# EAGLE schematic PDNode-600 Pro1 (EAGLE 9.2.1), part 1 of 3
COMPANY: DvidMakesThings; REVISION: 1.0.0; WEB: https://github.com/DvidMakesThings/HW_PDNode-600-Pro

## Sheet 1 of 15: MICROCONTROLLER - POWER
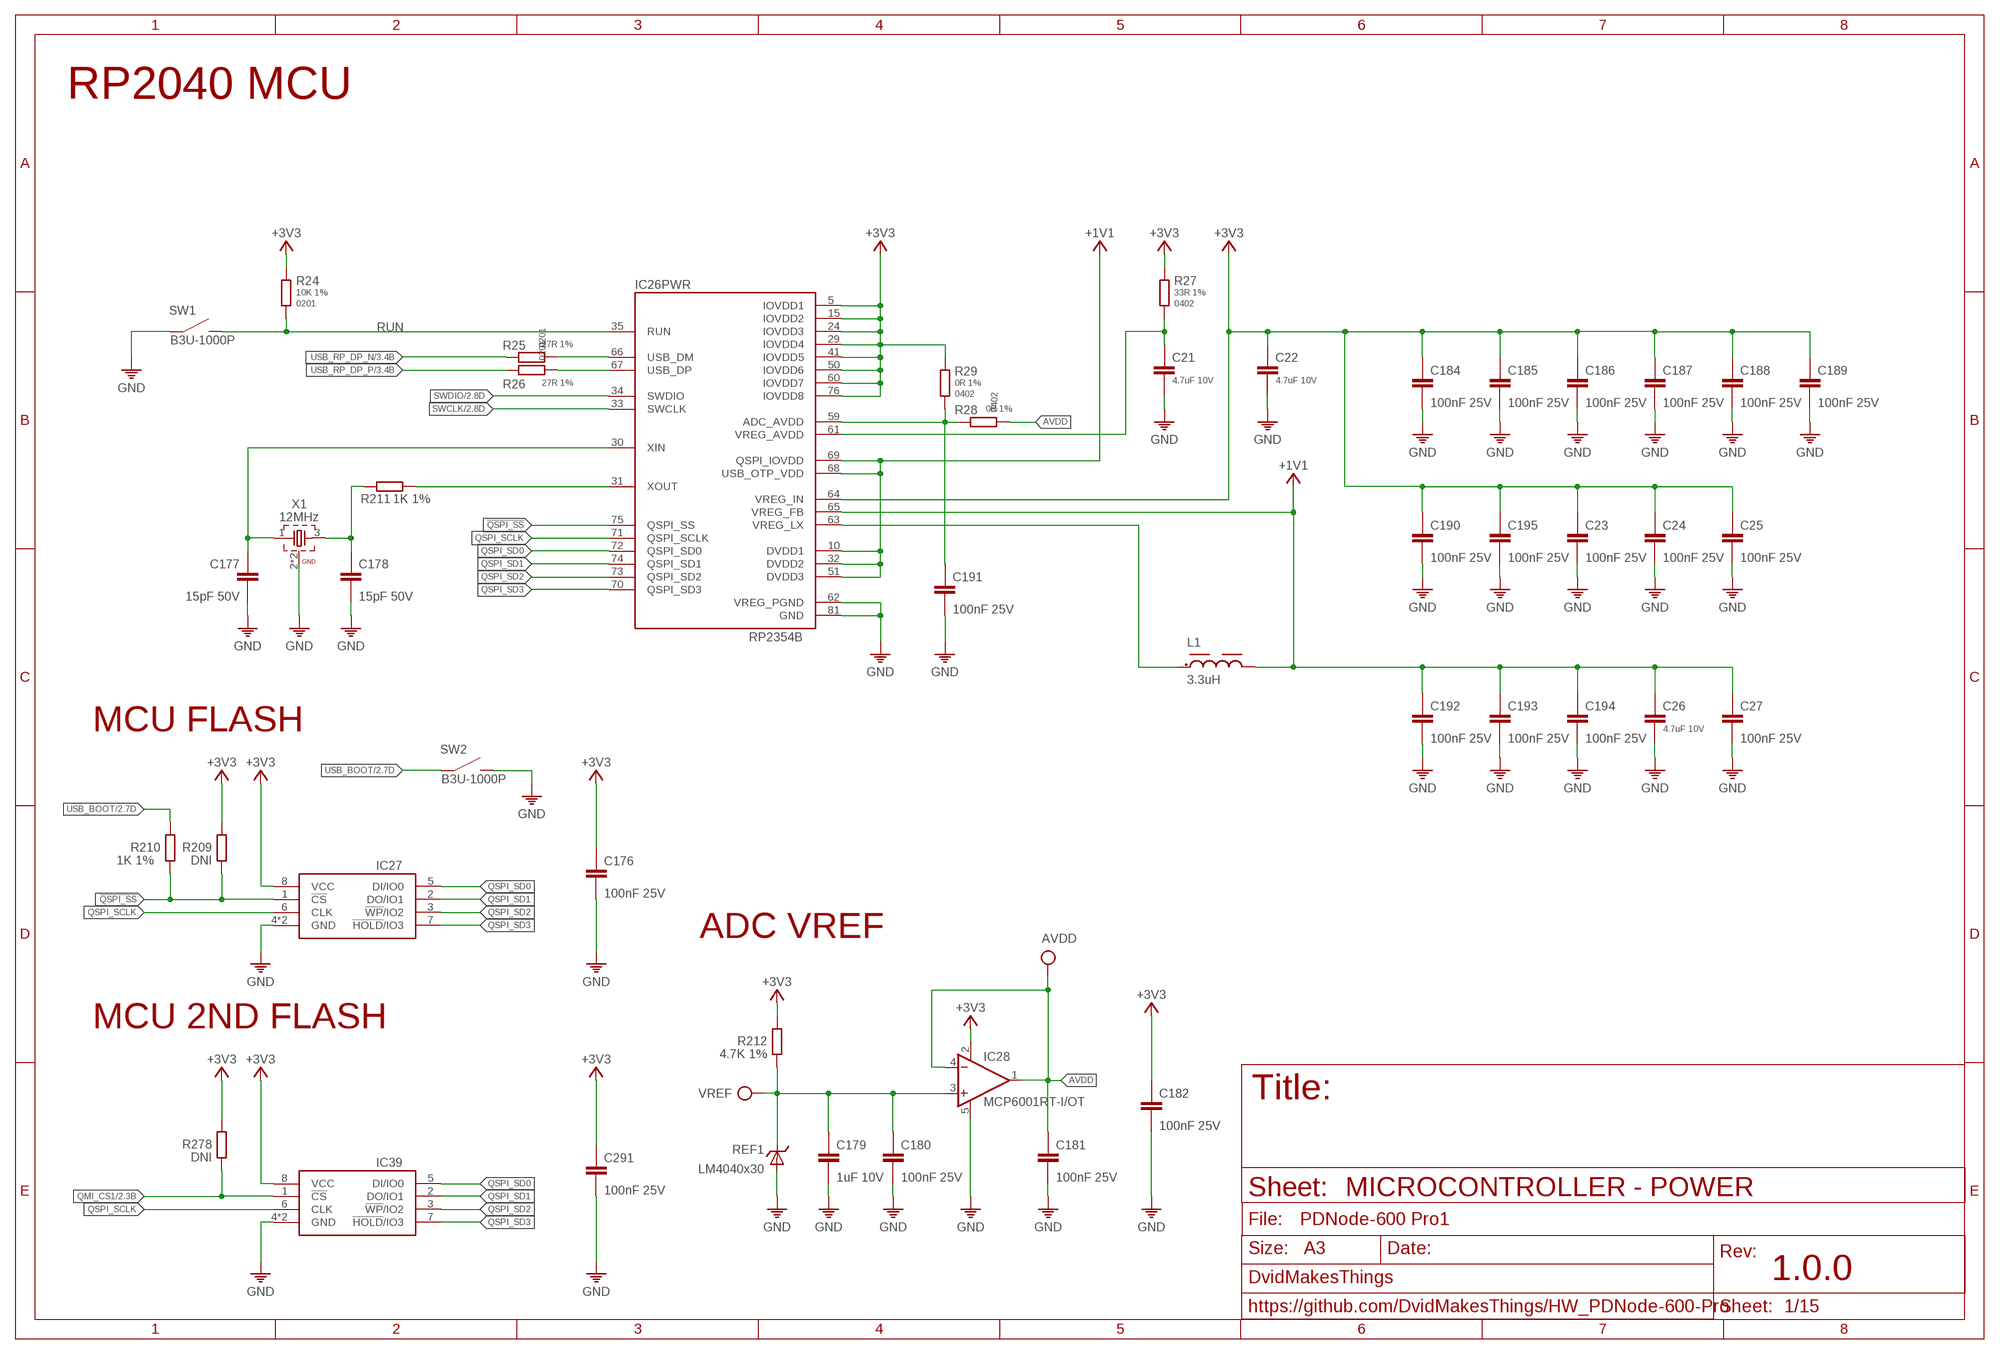
[diagram p0: schematic, sheet 1]

### Parts
AVDD  DNI  TP-ROUND  [TP-ROUND]
C21  4.7uF 10V  4.7UF-10V0402  [0402]
C22  4.7uF 10V  4.7UF-10V0402  [0402]
C23  100nF 25V  100NF-25V-0201  [0201]
C24  100nF 25V  100NF-25V-0201  [0201]
C25  100nF 25V  100NF-25V-0201  [0201]
C26  4.7uF 10V  4.7UF-10V0402  [0402]
C27  100nF 25V  100NF-25V-0201  [0201]
C176  100nF 25V  100NF-25V-0201  [0201]
C177  15pF 50V  15PF-50V0201  [0201]
C178  15pF 50V  15PF-50V0201  [0201]
C179  1uF 10V  1UF-10V0201  [0201]
C180  100nF 25V  100NF-25V-0201  [0201]
C181  100nF 25V  100NF-25V-0402  [0402]
C182  100nF 25V  100NF-25V-0201  [0201]
C184  100nF 25V  100NF-25V-0201  [0201]
C185  100nF 25V  100NF-25V-0201  [0201]
C186  100nF 25V  100NF-25V-0201  [0201]
C187  100nF 25V  100NF-25V-0201  [0201]
C188  100nF 25V  100NF-25V-0201  [0201]
C189  100nF 25V  100NF-25V-0201  [0201]
C190  100nF 25V  100NF-25V-0201  [0201]
C191  100nF 25V  100NF-25V-0201  [0201]
C192  100nF 25V  100NF-25V-0201  [0201]
C193  100nF 25V  100NF-25V-0201  [0201]
C194  100nF 25V  100NF-25V-0201  [0201]
C195  100nF 25V  100NF-25V-0201  [0201]
C291  100nF 25V  100NF-25V-0201  [0201]
IC26  RP2354B  RP235XB  [QFN80-10X10]
IC27  W25Q128JVPIQ  W25Q128JVP  [SON127P600X500X75-8N]
IC28  MCP6001RT-I/OT  MCP6001RT  [SOT23-5]
IC39  W25Q128JVPIQ  W25Q128JVP  [SON127P600X500X75-8N]
L1  3.3uH  3.3UH0805  [0805]
R24  10K 1%  10K-1%0201  [0201]
R25  27R 1%  27R-1%0201  [0201]
R26  27R 1%  27R-1%0201  [0201]
R27  33R 1%  33R-1%0402  [0402]
R28  0R 1%  0R0402  [0402]
R29  0R 1%  0R0402  [0402]
R209  DNI  R0201  [R0201]
R210  1K 1%  1K-1%0201  [0201]
R211  1K 1%  1K-1%0201  [0201]
R212  4.7K 1%  4.7K-1%0201  [0201]
R278  DNI  R0201  [R0201]
REF1  LM4040x30  LM4040BXX  [SOT23]
SW1  B3U-1000P  B3U-1000P  [B3U-1000P]
SW2  B3U-1000P  B3U-1000P  [B3U-1000P]
VREF  DNI  TP-ROUND  [TP-ROUND]
X1  12MHz  CRYSTAL-3225X322512MSB4SI  [WE-XTAL_CFPX-180]

### Nets
!QSPI_SS: IC26.75(PWR:QSPI_SS) IC27.1(!CS) R209.1 R210.2
+1V1: C26.1 C27.1 C192.1 C193.1 C194.1 IC26.10(PWR:DVDD1) IC26.32(PWR:DVDD2) IC26.51(PWR:DVDD3) IC26.65(PWR:VREG_FB) IC26.68(PWR:USB_OTP_VDD) IC26.69(PWR:QSPI_IOVDD) L1.2
+3V3: C22.1 C23.1 C24.1 C25.1 C176.1 C182.1 C184.1 C185.1 C186.1 C187.1 C188.1 C189.1 C190.1 C195.1 C291.1 IC26.5(PWR:IOVDD1) IC26.15(PWR:IOVDD2) IC26.24(PWR:IOVDD3) IC26.29(PWR:IOVDD4) IC26.41(PWR:IOVDD5) IC26.50(PWR:IOVDD6) IC26.60(PWR:IOVDD7) IC26.64(PWR:VREG_IN) IC26.76(PWR:IOVDD8) IC27.8(VCC) IC28.2(V+) IC39.8(VCC) R24.1 R27.1 R29.1 R209.2 R212.2 R278.2 ; also sheet 2,3,4,5,6,7,8,9,10,11,12,13,14,15
ADC_AVDD: C191.1 IC26.59(PWR:ADC_AVDD) R28.1 R29.2
AVDD: AVDD.TP C181.1 IC28.1(OUT) IC28.4(-IN) R28.2
GND: C21.2 C22.2 C23.2 C24.2 C25.2 C26.2 C27.2 C176.2 C177.2 C178.2 C179.2 C180.2 C181.2 C182.2 C184.2 C185.2 C186.2 C187.2 C188.2 C189.2 C190.2 C191.2 C192.2 C193.2 C194.2 C195.2 C291.2 IC26.62(PWR:VREG_PGND) IC26.81(PWR:GND) IC27.4(GND) IC27.PAD(GND) IC28.5(V-) IC39.4(GND) IC39.PAD(GND) REF1.2(A) REF1.3(A) SW1.1 SW2.2 X1.2(GND) X1.4(GND) ; also sheet 2,3,4,5,6,7,8,9,10,11,12,13,14,15
N$21: C21.1 IC26.61(PWR:VREG_AVDD) R27.2
N$23: IC26.63(PWR:VREG_LX) L1.1
N$43: C178.1 R211.1 X1.3
QMI_CS1: IC39.1(!CS) R278.1 ; also sheet 2
QSPI_SCLK: IC26.71(PWR:QSPI_SCLK) IC27.6(CLK) IC39.6(CLK)
QSPI_SD0: IC26.72(PWR:QSPI_SD0) IC27.5(DI/IO0) IC39.5(DI/IO0)
QSPI_SD1: IC26.74(PWR:QSPI_SD1) IC27.2(DO/IO1) IC39.2(DO/IO1)
QSPI_SD2: IC26.73(PWR:QSPI_SD2) IC27.3(!WP!/IO2) IC39.3(!WP!/IO2)
QSPI_SD3: IC26.70(PWR:QSPI_SD3) IC27.7(!HOLD!/IO3) IC39.7(!HOLD!/IO3)
RP_XI: C177.1 IC26.30(PWR:XIN) X1.1
RP_XO: IC26.31(PWR:XOUT) R211.2
RUN: IC26.35(PWR:RUN) R24.2 SW1.2 ; also sheet 2
SWCLK: IC26.33(PWR:SWCLK) ; also sheet 2
SWDIO: IC26.34(PWR:SWDIO) ; also sheet 2
USB_BOOT: R210.1 SW2.1 ; also sheet 2
USB_RP_DP_N: R25.1 ; also sheet 3
USB_RP_DP_P: R26.1 ; also sheet 3
USB_RPR_DP_N [90R_DIFFPAIR]: IC26.66(PWR:USB_DM) R25.2
USB_RPR_DP_P [90R_DIFFPAIR]: IC26.67(PWR:USB_DP) R26.2
VREF: C179.1 C180.1 IC28.3(+IN) R212.1 REF1.1(C) VREF.TP

### Notes on the sheet
- RP2040 MCU
- MCU FLASH
- ADC VREF
- MCU 2ND FLASH
- MICROCONTROLLER - POWER

## Sheet 2 of 15: MICROCONTROLLER - GPIO
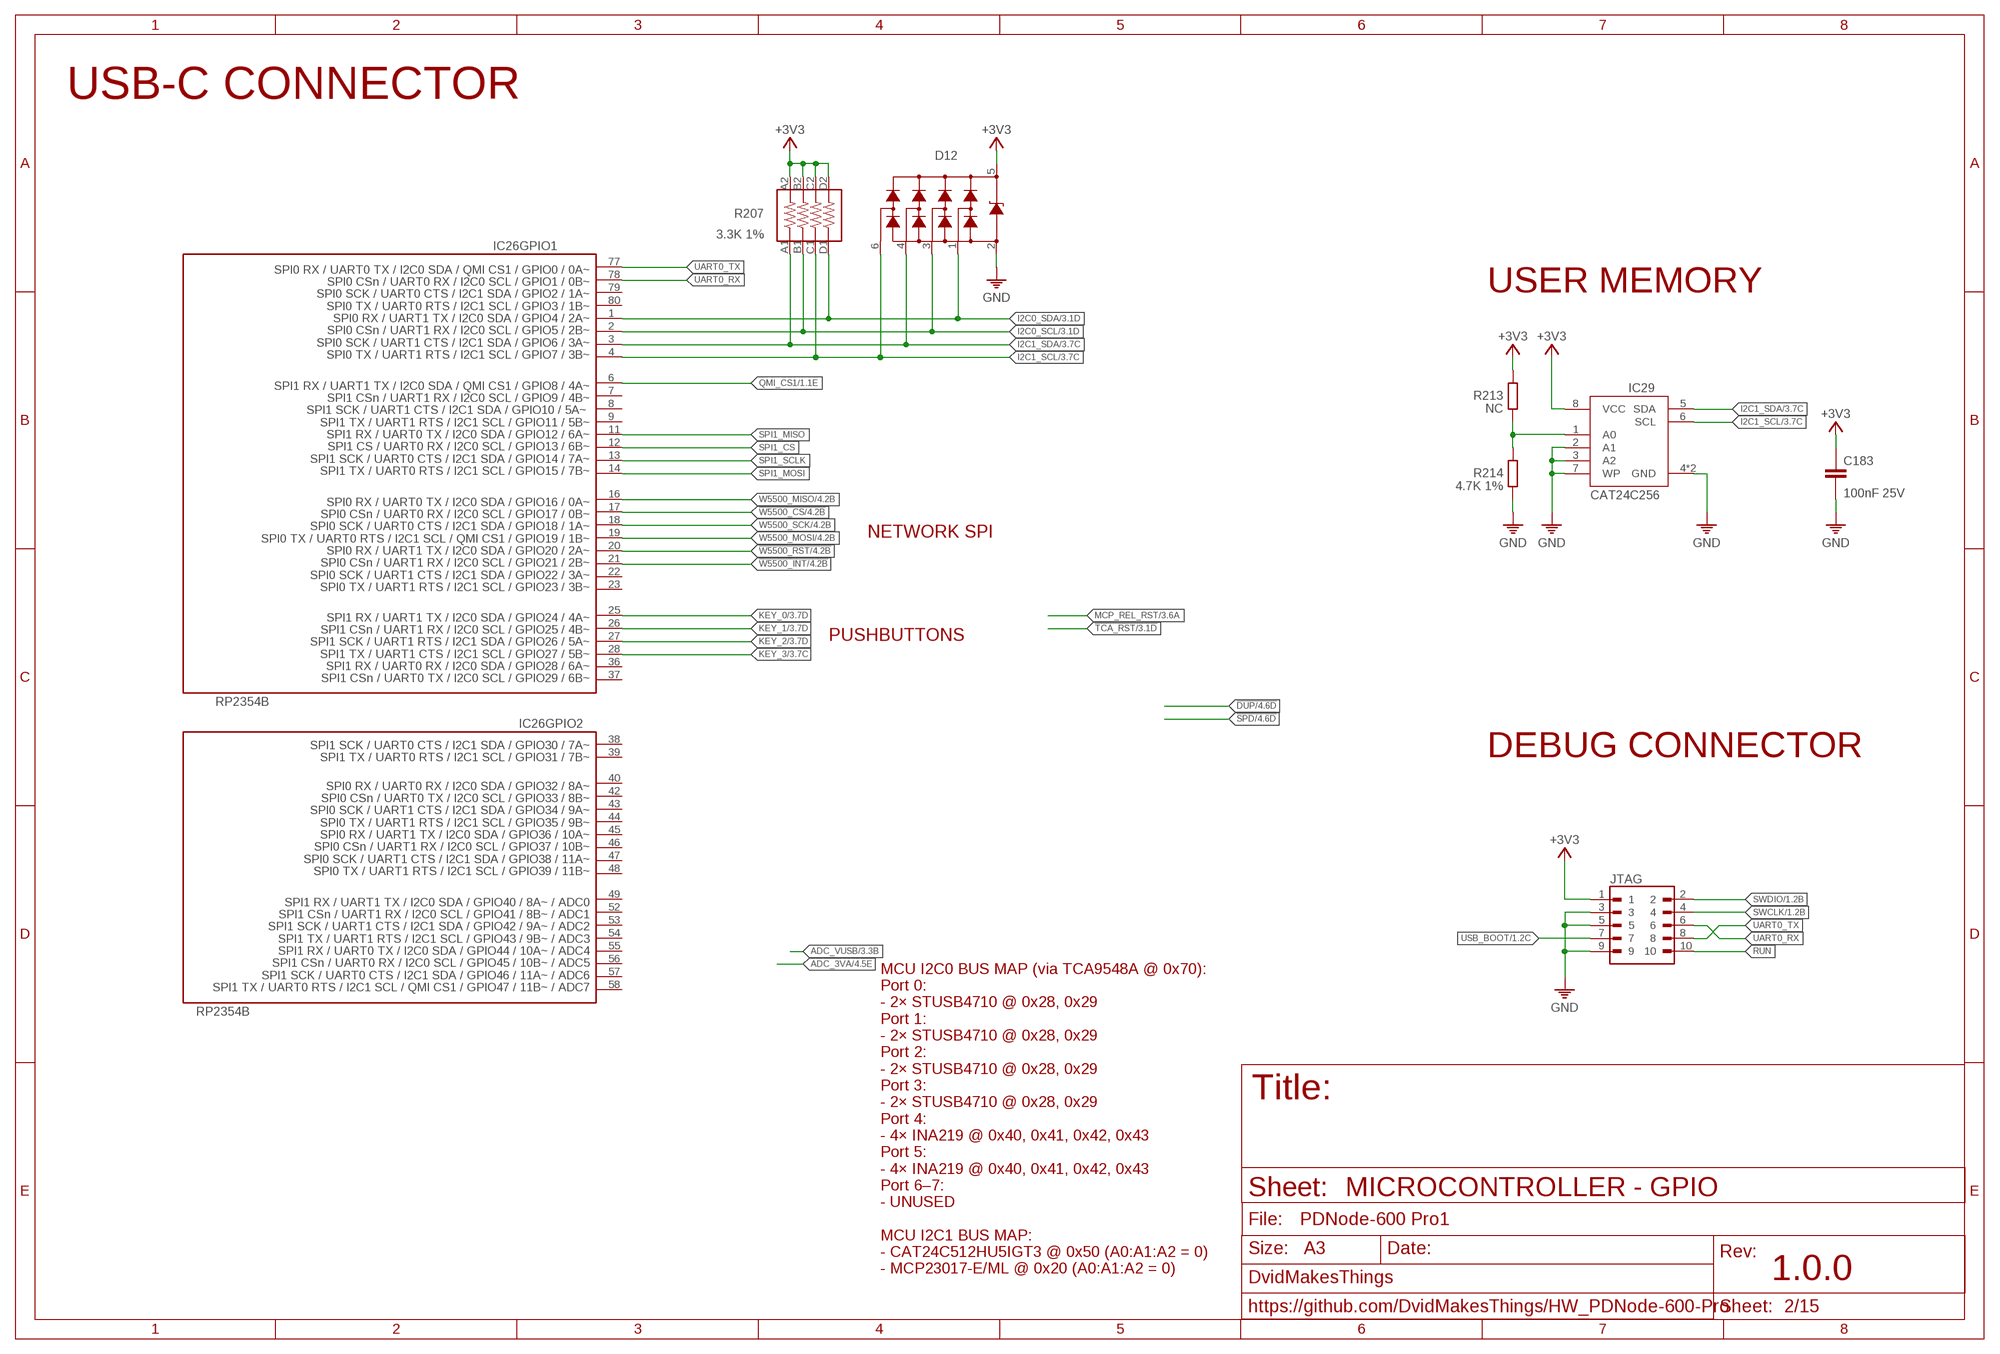
[diagram p1: schematic, sheet 2]

### Parts
C183  100nF 25V  100NF-25V-0201  [0201]
D12  HDMIULC6-4SC6Y  [SOT23-6]
IC29  CAT24C256HU4IGT3  CAT24C256-HU4  [SON50P300X200X50-9T130X140N]
JTAG  3220_10_0300_00  [3220_10_0300_00]
R207  3.3K 1%  3.3K-1%_ARRAY0603X4-1206  [_0603X4-1206]
R213  NC  R0201  [R0201]
R214  4.7K 1%  4.7K-1%0201  [0201]

### Nets
!W5500_CS: IC26.17(GPIO1:GPIO17) ; also sheet 4
!W5500_INT: IC26.21(GPIO1:GPIO21) ; also sheet 4
!W5500_RST: IC26.20(GPIO1:GPIO20) ; also sheet 4
+3V3: C183.1 D12.5 IC29.8(VCC) JTAG.1 R207.A2 R207.B2 R207.C2 R207.D2 R213.2 ; also sheet 1,3,4,5,6,7,8,9,10,11,12,13,14,15
GND: C183.2 D12.2 IC29.2(A1) IC29.3(A2) IC29.4(GND) IC29.7(WP) IC29.9(GND) JTAG.3 JTAG.5 JTAG.9 R214.1 ; also sheet 1,3,4,5,6,7,8,9,10,11,12,13,14,15
I2C0_SCL: D12.3 IC26.2(GPIO1:GPIO5) R207.B1 ; also sheet 3
I2C0_SDA: D12.1 IC26.1(GPIO1:GPIO4) R207.D1 ; also sheet 3
I2C1_SCL: D12.6 IC26.4(GPIO1:GPIO7) IC29.6(SCL) R207.C1 ; also sheet 3
I2C1_SDA: D12.4 IC26.3(GPIO1:GPIO6) IC29.5(SDA) R207.A1 ; also sheet 3
KEY_0: IC26.25(GPIO1:GPIO24) ; also sheet 3
KEY_1: IC26.26(GPIO1:GPIO25) ; also sheet 3
KEY_2: IC26.27(GPIO1:GPIO26) ; also sheet 3
KEY_3: IC26.28(GPIO1:GPIO27) ; also sheet 3
N$222: IC29.1(A0) R213.1 R214.2
QMI_CS1: IC26.6(GPIO1:GPIO8) ; also sheet 1
RUN: JTAG.10 ; also sheet 1
SPI1_CS: IC26.12(GPIO1:GPIO13)
SPI1_MISO: IC26.11(GPIO1:GPIO12)
SPI1_MOSI: IC26.14(GPIO1:GPIO15)
SPI1_SCLK: IC26.13(GPIO1:GPIO14)
SWCLK: JTAG.4 ; also sheet 1
SWDIO: JTAG.2 ; also sheet 1
UART0_RX: IC26.78(GPIO1:GPIO1) JTAG.6
UART0_TX: IC26.77(GPIO1:GPIO0) JTAG.8
USB_BOOT: JTAG.7 ; also sheet 1
W5500_MISO: IC26.16(GPIO1:GPIO16) ; also sheet 4
W5500_MOSI: IC26.19(GPIO1:GPIO19) ; also sheet 4
W5500_SCK: IC26.18(GPIO1:GPIO18) ; also sheet 4
Unconnected: IC26.7(GPIO1:GPIO9) IC26.8(GPIO1:GPIO10) IC26.9(GPIO1:GPIO11) IC26.22(GPIO1:GPIO22) IC26.23(GPIO1:GPIO23) IC26.36(GPIO1:GPIO28) IC26.37(GPIO1:GPIO29) IC26.38(GPIO2:GPIO30) IC26.39(GPIO2:GPIO31) IC26.40(GPIO2:GPIO32) IC26.42(GPIO2:GPIO33) IC26.43(GPIO2:GPIO34) IC26.44(GPIO2:GPIO35) IC26.45(GPIO2:GPIO36) IC26.46(GPIO2:GPIO37) IC26.47(GPIO2:GPIO38) IC26.48(GPIO2:GPIO39) IC26.49(GPIO2:GPIO40_ADC0) IC26.52(GPIO2:GPIO41_ADC1) IC26.53(GPIO2:GPIO42_ADC2) IC26.54(GPIO2:GPIO43_ADC3) IC26.55(GPIO2:GPIO44_ADC4) IC26.56(GPIO2:GPIO45_ADC5) IC26.57(GPIO2:GPIO46_ADC6) IC26.58(GPIO2:GPIO47_ADC7) IC26.79(GPIO1:GPIO2) IC26.80(GPIO1:GPIO3)

### Notes on the sheet
- USB-C CONNECTOR
- USER MEMORY
- NETWORK SPI
- PUSHBUTTONS
- DEBUG CONNECTOR
- MICROCONTROLLER - GPIO
- MCU I2C0 BUS MAP (via TCA9548A @ 0x70):
  Port 0:
  - 2× STUSB4710 @ 0x28, 0x29
  Port 1:
  - 2× STUSB4710 @ 0x28, 0x29
  Port 2:
  - 2× STUSB4710 @ 0x28, 0x29
  Port 3:
  - 2× STUSB4710 @ 0x28, 0x29
  Port 4:
  - 4× INA219 @ 0x40, 0x41, 0x42, 0x43
  Port 5:
  - 4× INA219 @ 0x40, 0x41, 0x42, 0x43
  Port 6–7:
  - UNUSED
  
  MCU I2C1 BUS MAP:
  - CAT24C512HU5IGT3 @ 0x50 (A0:A1:A2 = 0)
  - MCP23017-E/ML @ 0x20 (A0:A1:A2 = 0)

## Sheet 3 of 15: PERIPHERALS
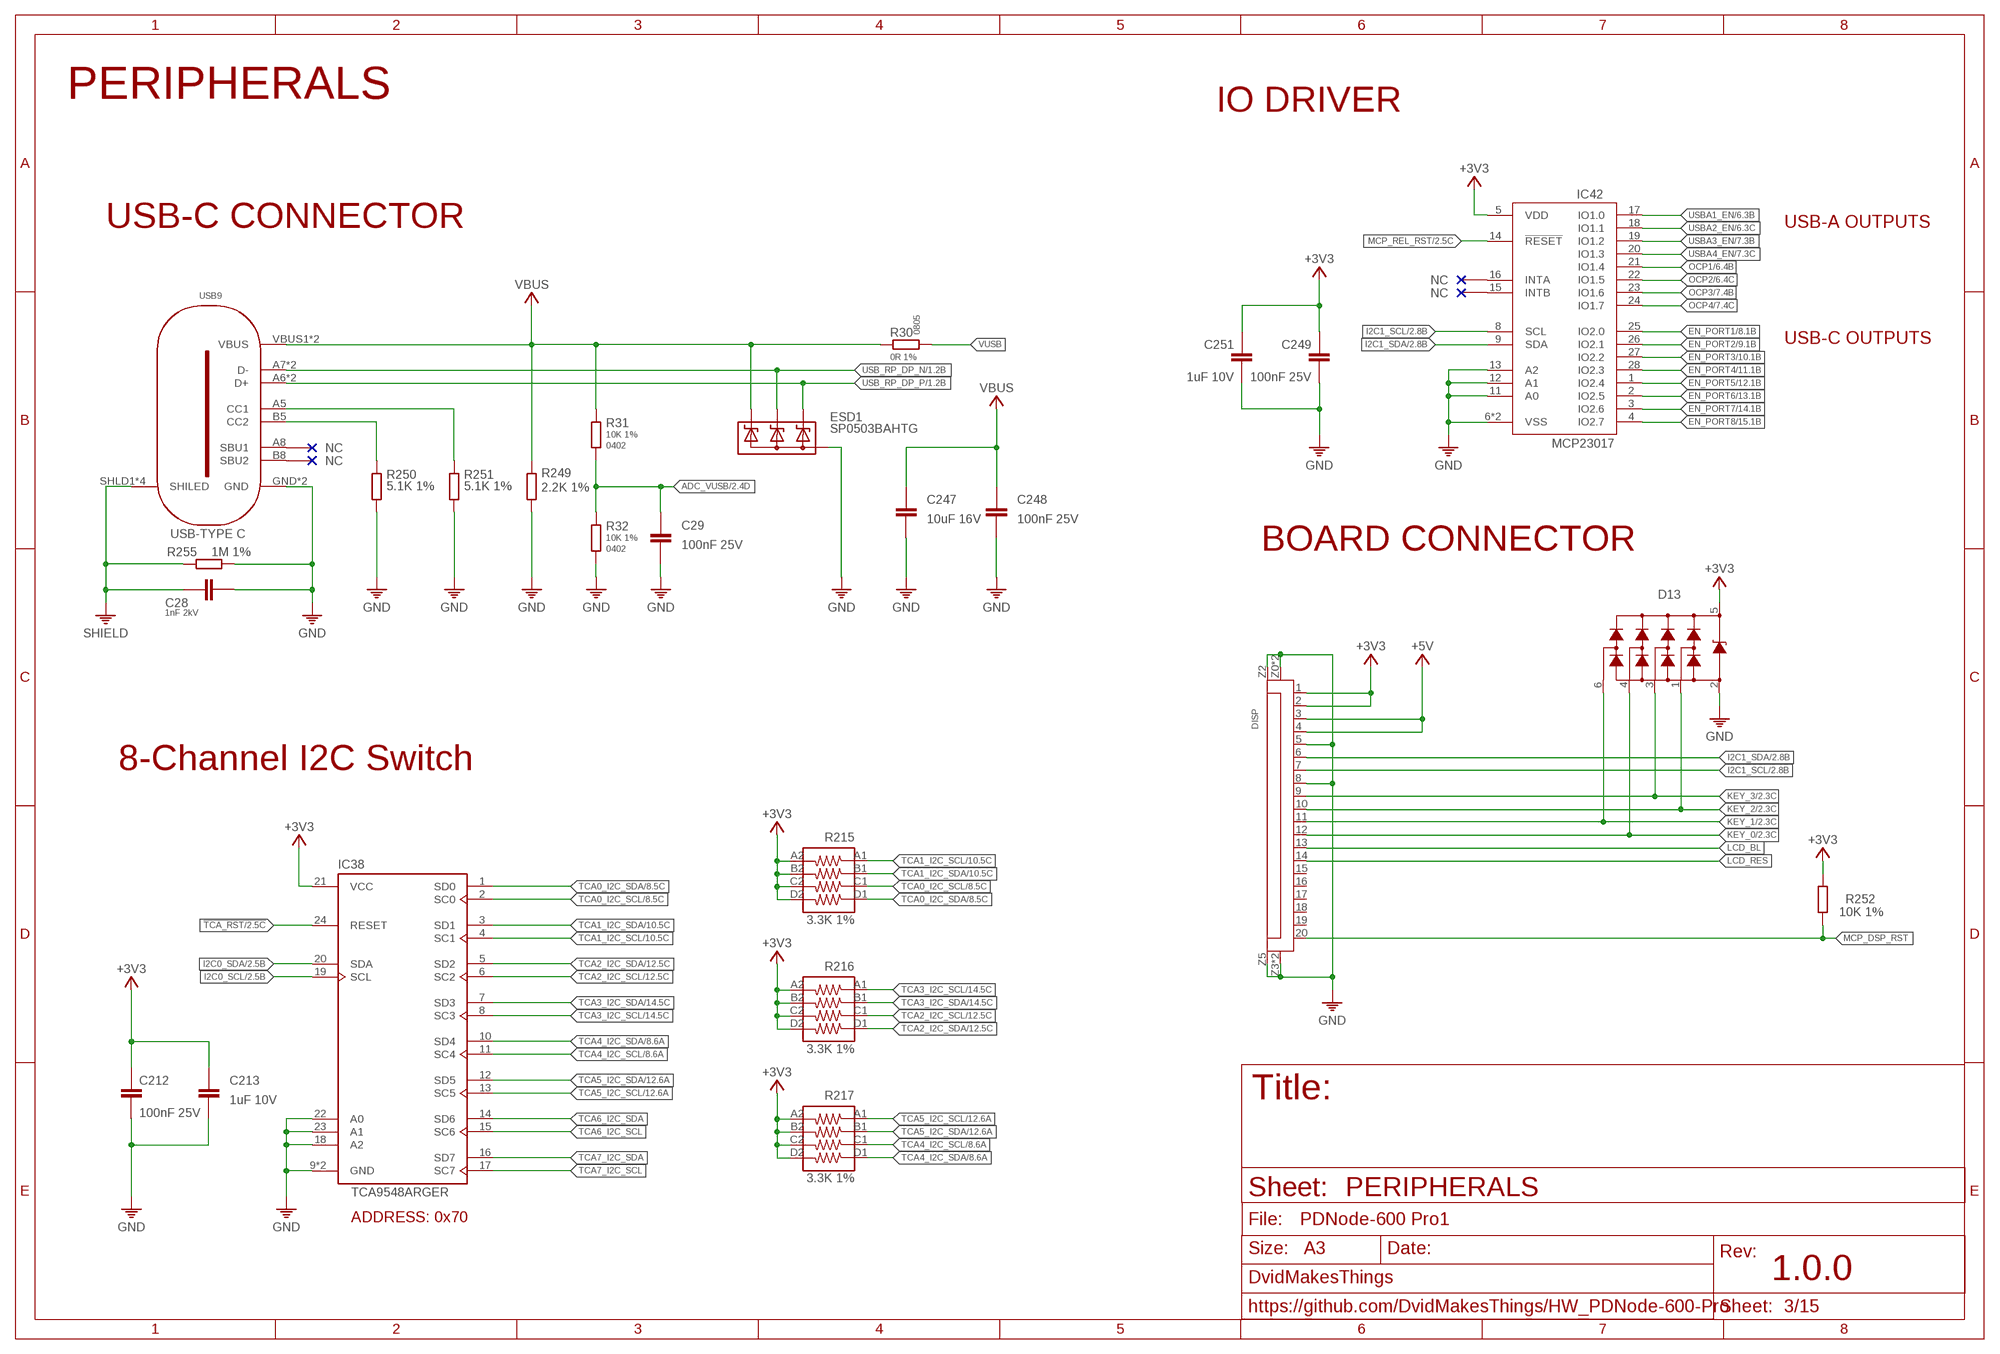
[diagram p2: schematic, sheet 3]

### Parts
C28  1nF 2kV  1NF-2KV  [1206]
C29  100nF 25V  100NF-25V-0402  [0402]
C212  100nF 25V  100NF-25V-0201  [0201]
C213  1uF 10V  1UF-10V0201  [0201]
C247  10uF 16V  10UF-16V-0603  [0603]
C248  100nF 25V  100NF-25V-0402  [0402]
C249  100nF 25V  100NF-25V-0201  [0201]
C251  1uF 10V  1UF-10V0201  [0201]
D13  HDMIULC6-4SC6Y  [SOT23-6]
DISP  AFC11-S20ICC-00  AFC11-S20ICC-00  [FPC20]
ESD1  SP0503BAHTG  SP0503BAHT  [SOT143]
IC38  TCA9548ARGER  [QFN50P400X400X100-25T210N]
IC42  MCP23017T-E/ML  MCP23017-E/ML  [QFN28[6X6]ML]
R30  0R 1%  0R0805  [0805]
R31  10K 1%  10K-1%0402  [0402]
R32  10K 1%  10K-1%0402  [0402]
R215  3.3K 1%  3.3K-1%_ARRAY0603X4-1206  [_0603X4-1206]
R216  3.3K 1%  3.3K-1%_ARRAY0603X4-1206  [_0603X4-1206]
R217  3.3K 1%  3.3K-1%_ARRAY0603X4-1206  [_0603X4-1206]
R249  2.2K 1%  2.2K-1%0201  [0201]
R250  5.1K 1%  5.1K-1%0201  [0201]
R251  5.1K 1%  5.1K-1%0201  [0201]
R252  10K 1%  10K-1%0201  [0201]
R255  1M 1%  1M-1%1206  [1206]
USB9  USB-TYPE-C-018  USB_C-THT  [USB-C]

### Nets
!TCA_RST: IC38.24(RESET) ; also sheet 2
+3V3: C212.1 C213.1 C249.1 C251.1 D13.5 DISP.1 DISP.2 IC38.21(VCC) IC42.5(VDD) R215.A2 R215.B2 R215.C2 R215.D2 R216.A2 R216.B2 R216.C2 R216.D2 R217.A2 R217.B2 R217.C2 R217.D2 R252.2 ; also sheet 1,2,4,5,6,7,8,9,10,11,12,13,14,15
+5V: DISP.3 DISP.4
ADC_VUSB: C29.1 R31.2 R32.1 ; also sheet 2
CC1: R251.1 USB9.A5(CC1)
CC2: R250.1 USB9.B5(CC2)
EN_PORT1: IC42.25(IO2.0) ; also sheet 8
EN_PORT2: IC42.26(IO2.1) ; also sheet 9
EN_PORT3: IC42.27(IO2.2) ; also sheet 10
EN_PORT4: IC42.28(IO2.3) ; also sheet 11
EN_PORT5: IC42.1(IO2.4) ; also sheet 12
EN_PORT6: IC42.2(IO2.5) ; also sheet 13
EN_PORT7: IC42.3(IO2.6) ; also sheet 14
EN_PORT8: IC42.4(IO2.7) ; also sheet 15
GND: C28.2 C29.2 C212.2 C213.2 C247.2 C248.2 C249.2 C251.2 D13.2 DISP.5 DISP.8 DISP.Z0(Z1) DISP.Z1 DISP.Z2 DISP.Z3 DISP.Z4(Z3) DISP.Z5(Z4) ESD1.1(A) IC38.9(GND) IC38.18(A2) IC38.22(A0) IC38.23(A1) IC38.25(GND) IC42.6(VSS) IC42.11(A0) IC42.12(A1) IC42.13(A2) IC42.PAD(VSS) R32.2 R249.2 R250.2 R251.2 R255.2 USB9.GND USB9.GND2(GND) ; also sheet 1,2,4,5,6,7,8,9,10,11,12,13,14,15
I2C0_SCL: IC38.19(SCL) ; also sheet 2
I2C0_SDA: IC38.20(SDA) ; also sheet 2
I2C1_SCL: DISP.7 IC42.8(SCL) ; also sheet 2
I2C1_SDA: DISP.6 IC42.9(SDA) ; also sheet 2
KEY_0: D13.4 DISP.12 ; also sheet 2
KEY_1: D13.6 DISP.11 ; also sheet 2
KEY_2: D13.1 DISP.10 ; also sheet 2
KEY_3: D13.3 DISP.9 ; also sheet 2
LCD_BL: DISP.13
LCD_RES: DISP.14
MCP_DSP_RST: DISP.20 R252.1
MCP_REL_RST: IC42.14(!RESET) ; also sheet 2
OCP1: IC42.21(IO1.4) ; also sheet 6
OCP2: IC42.22(IO1.5) ; also sheet 6
OCP3: IC42.23(IO1.6) ; also sheet 7
OCP4: IC42.24(IO1.7) ; also sheet 7
SHIELD: C28.1 R255.1 USB9.SHLD1(SHILED) USB9.SHLD2(SHILED) USB9.SHLD3(SHILED) USB9.SHLD4(SHILED) ; also sheet 4,6,7,8,9,10,11,12,13,14,15
TCA0_I2C_SCL: IC38.2(SC0) R215.C1 ; also sheet 8,9
TCA0_I2C_SDA: IC38.1(SD0) R215.D1 ; also sheet 8,9
TCA1_I2C_SCL: IC38.4(SC1) R215.A1 ; also sheet 10,11
TCA1_I2C_SDA: IC38.3(SD1) R215.B1 ; also sheet 10,11
TCA2_I2C_SCL: IC38.6(SC2) R216.C1 ; also sheet 12,13
TCA2_I2C_SDA: IC38.5(SD2) R216.D1 ; also sheet 12,13
TCA3_I2C_SCL: IC38.8(SC3) R216.A1 ; also sheet 14,15
TCA3_I2C_SDA: IC38.7(SD3) R216.B1 ; also sheet 14,15
TCA4_I2C_SCL: IC38.11(SC4) R217.C1 ; also sheet 8,9,10,11
TCA4_I2C_SDA: IC38.10(SD4) R217.D1 ; also sheet 8,9,10,11
TCA5_I2C_SCL: IC38.13(SC5) R217.A1 ; also sheet 12,13,14,15
TCA5_I2C_SDA: IC38.12(SD5) R217.B1 ; also sheet 12,13,14,15
TCA6_I2C_SCL: IC38.15(SC6)
TCA6_I2C_SDA: IC38.14(SD6)
TCA7_I2C_SCL: IC38.17(SC7)
TCA7_I2C_SDA: IC38.16(SD7)
USB_RP_DP_N: ESD1.3(C2) USB9.A7(D-) USB9.B7(D-) ; also sheet 1
USB_RP_DP_P: ESD1.2(C1) USB9.A6(D+) USB9.B6(D+) ; also sheet 1
USBA1_EN: IC42.17(IO1.0) ; also sheet 6
USBA2_EN: IC42.18(IO1.1) ; also sheet 6
USBA3_EN: IC42.19(IO1.2) ; also sheet 7
USBA4_EN: IC42.20(IO1.3) ; also sheet 7
VBUS: C247.1 C248.1 ESD1.4(C3) R30.1 R31.1 R249.1 USB9.VBUS1(VBUS) USB9.VBUS2(VBUS)
VUSB: R30.2
Unconnected: DISP.15 DISP.16 DISP.17 DISP.18 DISP.19 IC42.15(INTB) IC42.16(INTA) USB9.A8(SBU1) USB9.B8(SBU2)

### Notes on the sheet
- PERIPHERALS
- IO DRIVER
- USB-C CONNECTOR | USB-A OUTPUTS
- USB-C OUTPUTS
- BOARD CONNECTOR
- 8-Channel I2C Switch
- PERIPHERALS
- ADDRESS: 0x70

## Sheet 4 of 15: ETHERNET CONTROLLER
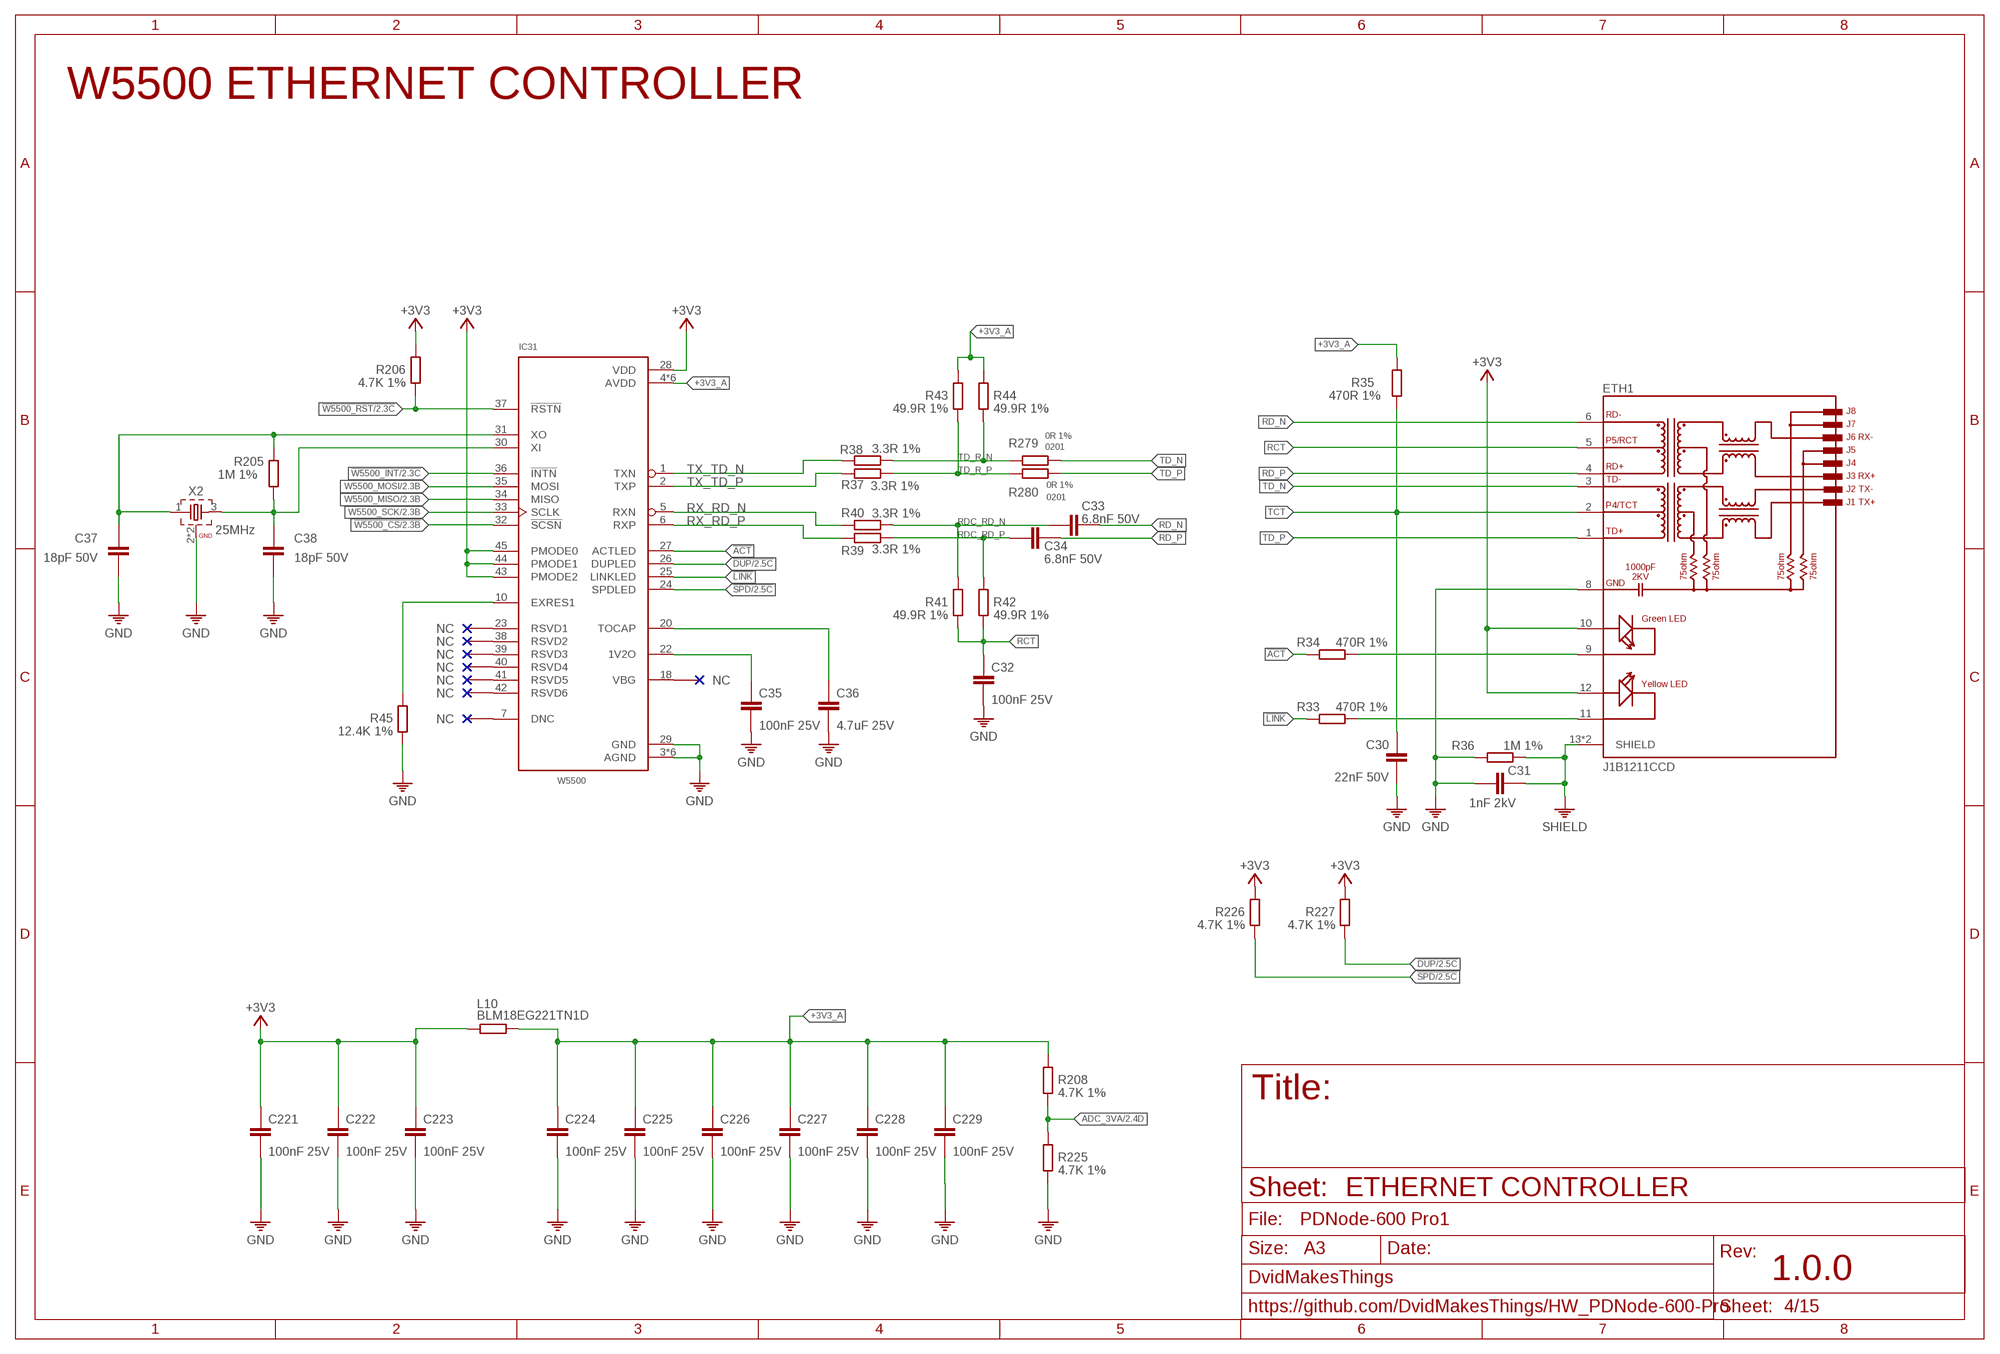
[diagram p3: schematic, sheet 4]

### Parts
C30  22nF 50V  22NF-50V0402  [0402]
C31  1nF 2kV  1NF-2KV  [1206]
C32  100nF 25V  100NF-25V-0402  [0402]
C33  6.8nF 50V  6.8NF-50V0201  [0201]
C34  6.8nF 50V  6.8NF-50V0201  [0201]
C35  100nF 25V  100NF-25V-0201  [0201]
C36  4.7uF 25V  4.7UF-25V0402  [0402]
C37  18pF 50V  18PF-50V-0201  [0201]
C38  18pF 50V  18PF-50V-0201  [0201]
C221  100nF 25V  100NF-25V-0201  [0201]
C222  100nF 25V  100NF-25V-0201  [0201]
C223  100nF 25V  100NF-25V-0201  [0201]
C224  100nF 25V  100NF-25V-0201  [0201]
C225  100nF 25V  100NF-25V-0201  [0201]
C226  100nF 25V  100NF-25V-0201  [0201]
C227  100nF 25V  100NF-25V-0201  [0201]
C228  100nF 25V  100NF-25V-0201  [0201]
C229  100nF 25V  100NF-25V-0201  [0201]
ETH1  J1B1211CCD  [J1B1211CCD]
IC31  W5500  [LQFP48]
L10  BLM18EG221TN1D  R0603  [0603]
R33  470R 1%  470R-1%0402  [0402]
R34  470R 1%  470R-1%0402  [0402]
R35  470R 1%  470R-1%0402  [0402]
R36  1M 1%  1M-1%1206  [1206]
R37  3.3R 1%  3.3R-1%0201  [0201]
R38  3.3R 1%  3.3R-1%0201  [0201]
R39  3.3R 1%  3.3R-1%0201  [0201]
R40  3.3R 1%  3.3R-1%0201  [0201]
R41  49.9R 1%  49.9R-1%0201  [0201]
R42  49.9R 1%  49.9R-1%0201  [0201]
R43  49.9R 1%  49.9R-1%0201  [0201]
R44  49.9R 1%  49.9R-1%0201  [0201]
R45  12.4K 1%  R0201  [R0201]
R205  1M 1%  1M-1%0201  [0201]
R206  4.7K 1%  4.7K-1%0201  [0201]
R208  4.7K 1%  4.7K-1%0201  [0201]
R225  4.7K 1%  4.7K-1%0201  [0201]
R226  4.7K 1%  4.7K-1%0201  [0201]
R227  4.7K 1%  4.7K-1%0201  [0201]
R279  0R 1%  0R0201  [0201]
R280  0R 1%  0R0201  [0201]
X2  25MHz  CRYSTAL-3225X322525MOB4SI  [WE-XTAL_CFPX-180]

### Nets
!ACT: IC31.27(ACTLED) R34.1
!DUP: IC31.26(DUPLED) R227.1 ; also sheet 2
!LINK: IC31.25(LINKLED) R33.1
!SPD: IC31.24(SPDLED) R226.1 ; also sheet 2
!W5500_CS: IC31.32(!SCSN) ; also sheet 2
!W5500_INT: IC31.36(!INTN) ; also sheet 2
!W5500_RST: IC31.37(!RSTN) R206.1 ; also sheet 2
+3V3: C221.1 C222.1 C223.1 ETH1.10(GREEN+) ETH1.12(YELLOW+) IC31.28(VDD) IC31.43(PMODE2) IC31.44(PMODE1) IC31.45(PMODE0) L10.1 R206.2 R226.2 R227.2 ; also sheet 1,2,3,5,6,7,8,9,10,11,12,13,14,15
+3V3_A: C224.1 C225.1 C226.1 C227.1 C228.1 C229.1 IC31.4(AVDD) IC31.8(AVDD) IC31.11(AVDD) IC31.15(AVDD) IC31.17(AVDD) IC31.21(AVDD) L10.2 R35.2 R43.2 R44.2 R208.2
ADC_3VA: R208.1 R225.2 ; also sheet 2
GND: C30.2 C31.1 C32.2 C35.2 C36.2 C37.2 C38.2 C221.2 C222.2 C223.2 C224.2 C225.2 C226.2 C227.2 C228.2 C229.2 ETH1.8(GND) IC31.3(AGND) IC31.9(AGND) IC31.14(AGND) IC31.16(AGND) IC31.19(AGND) IC31.29(GND) IC31.48(AGND) R36.1 R45.1 R225.1 X2.2(GND) X2.4(GND) ; also sheet 1,2,3,5,6,7,8,9,10,11,12,13,14,15
N$19: ETH1.11(YELLOW-) R33.2
N$22: ETH1.9(GREEN-) R34.2
N$24: IC31.10(EXRES1) R45.2
N$25: C35.1 IC31.22(1V2O)
N$26: C36.1 IC31.20(TOCAP)
N$27: C38.1 IC31.30(XI) R205.1 X2.3
RCT: C32.1 ETH1.5(P5/RCT) R41.1 R42.1
RD_N [100R_DIFFPAIR]: C33.2 ETH1.6(RD-)
RD_P [100R_DIFFPAIR]: C34.2 ETH1.4(RD+)
RDC_RD_N [100R_DIFFPAIR]: C33.1 R40.2 R41.2
RDC_RD_P [100R_DIFFPAIR]: C34.1 R39.2 R42.2
RX_RD_N [100R_DIFFPAIR]: IC31.5(RXN) R40.1
RX_RD_P [100R_DIFFPAIR]: IC31.6(RXP) R39.1
SHIELD: C31.2 ETH1.13(SHIELD) ETH1.14(SHIELD) R36.2 ; also sheet 3,6,7,8,9,10,11,12,13,14,15
TCT: C30.1 ETH1.2(P4/TCT) R35.1
TD_N [100R_DIFFPAIR]: ETH1.3(TD-) R279.2
TD_P [100R_DIFFPAIR]: ETH1.1(TD+) R280.2
TD_R_N [100R_DIFFPAIR]: R38.2 R44.1 R279.1
TD_R_P [100R_DIFFPAIR]: R37.2 R43.1 R280.1
TX_TD_N [100R_DIFFPAIR]: IC31.1(TXN) R38.1
TX_TD_P [100R_DIFFPAIR]: IC31.2(TXP) R37.1
W5500_MISO: IC31.34(MISO) ; also sheet 2
W5500_MOSI: IC31.35(MOSI) ; also sheet 2
W5500_SCK: IC31.33(SCLK) ; also sheet 2
XO: C37.1 IC31.31(XO) R205.2 X2.1
Unconnected: IC31.7(DNC) IC31.18(VBG) IC31.23(RSVD1) IC31.38(RSVD2) IC31.39(RSVD3) IC31.40(RSVD4) IC31.41(RSVD5) IC31.42(RSVD6)

### Notes on the sheet
- W5500 ETHERNET CONTROLLER
- ETHERNET CONTROLLER

## Sheet 5 of 15: POWER
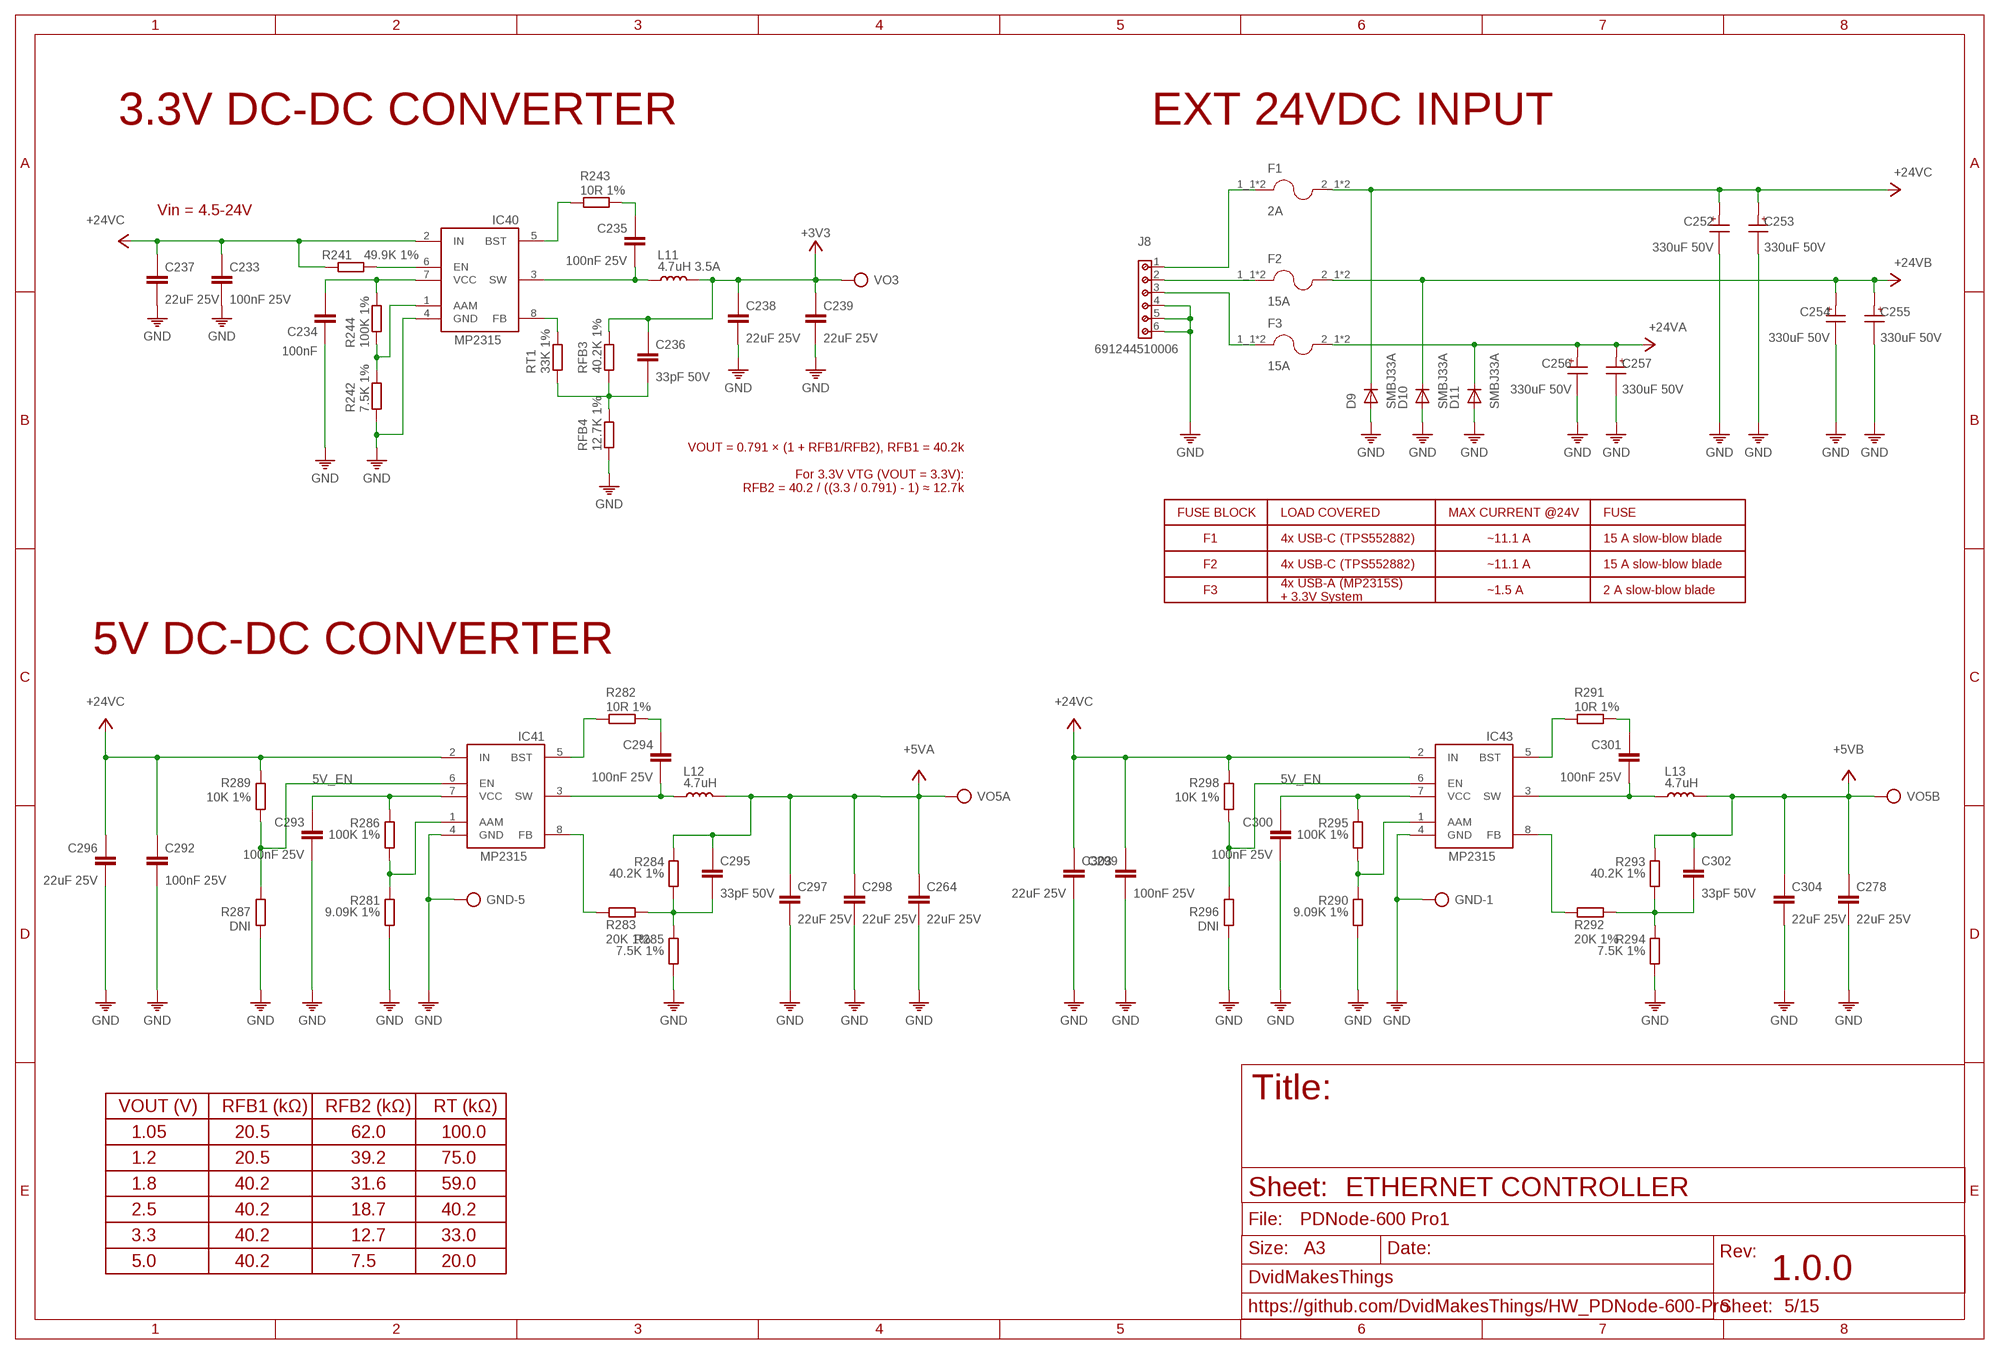
[diagram p4: schematic, sheet 5]

### Parts
C233  100nF 25V  100NF-25V-0201  [0201]
C234  100nF  C-0201  [0201]
C235  100nF 25V  100NF-25V-0201  [0201]
C236  33pF 50V  33PF-50V0201  [0201]
C237  22uF 25V  22UF-25V-1206  [1206]
C238  22uF 25V  22UF-25V-1206  [1206]
C239  22uF 25V  22UF-25V-1206  [1206]
C252  330uF 50V  330UF-50V10X10.5(DXL)  [10X10.5(DXL)]
C253  330uF 50V  330UF-50V10X10.5(DXL)  [10X10.5(DXL)]
C254  330uF 50V  330UF-50V10X10.5(DXL)  [10X10.5(DXL)]
C255  330uF 50V  330UF-50V10X10.5(DXL)  [10X10.5(DXL)]
C256  330uF 50V  330UF-50V10X10.5(DXL)  [10X10.5(DXL)]
C257  330uF 50V  330UF-50V10X10.5(DXL)  [10X10.5(DXL)]
C264  22uF 25V  22UF-25V-1206  [1206]
C278  22uF 25V  22UF-25V-1206  [1206]
C292  100nF 25V  100NF-25V-0402  [0402]
C293  100nF 25V  100NF-25V-0402  [0402]
C294  100nF 25V  100NF-25V-0402  [0402]
C295  33pF 50V  33PF-50V0402  [0402]
C296  22uF 25V  22UF-25V-1206  [1206]
C297  22uF 25V  22UF-25V-1206  [1206]
C298  22uF 25V  22UF-25V-1206  [1206]
C299  100nF 25V  100NF-25V-0402  [0402]
C300  100nF 25V  100NF-25V-0402  [0402]
C301  100nF 25V  100NF-25V-0402  [0402]
C302  33pF 50V  33PF-50V0402  [0402]
C303  22uF 25V  22UF-25V-1206  [1206]
C304  22uF 25V  22UF-25V-1206  [1206]
D9  SMBJ33A  DIODE-SMB  [SMB]
D10  SMBJ33A  DIODE-SMB  [SMB]
D11  SMBJ33A  DIODE-SMB  [SMB]
F1  2A  BLADE-FUSE  [FUSE_3544-2]
F2  15A  BLADE-FUSE  [FUSE_3544-2]
F3  15A  BLADE-FUSE  [FUSE_3544-2]
GND-1  DNI  TP-ROUND  [TP-ROUND]
GND-5  DNI  TP-ROUND  [TP-ROUND]
IC40  MP2315GJ-Z  MP2315TSOT23-8  [SOT65P280X110-8N]
IC41  MP2315GJ-Z  MP2315TSOT23-8  [SOT65P280X110-8N]
IC43  MP2315GJ-Z  MP2315TSOT23-8  [SOT65P280X110-8N]
J8  691244510006  [691244510006]
L11  4.7uH 3.5A  4.2UH  [SRR5228A]
L12  4.7uH  4.7UH  [SRR5228A]
L13  4.7uH  4.7UH  [SRR5228A]
R241  49.9K 1%  49.9K-1%0201  [0201]
R242  7.5K 1%  7.5K-1%0201  [0201]
R243  10R 1%  10R-1%0201  [0201]
R244  100K 1%  100K-1%0201  [0201]
R281  9.09K 1%  9.09K-1%0402  [0402]
R282  10R 1%  10R-1%0402  [0402]
R283  20K 1%  20K-1%0402  [0402]
R284  40.2K 1%  40.2K-1%0402  [0402]
R285  7.5K 1%  7.5K-1%0402  [0402]
R286  100K 1%  100K-1%0402  [0402]
R287  DNI  R0402  [0402]
R289  10K 1%  10K-1%0402  [0402]
R290  9.09K 1%  9.09K-1%0402  [0402]
R291  10R 1%  10R-1%0402  [0402]
R292  20K 1%  20K-1%0402  [0402]
R293  40.2K 1%  40.2K-1%0402  [0402]
R294  7.5K 1%  7.5K-1%0402  [0402]
R295  100K 1%  100K-1%0402  [0402]
R296  DNI  R0402  [0402]
R298  10K 1%  10K-1%0402  [0402]
RFB3  40.2K 1%  40.2K-1%0201  [0201]
RFB4  12.7K 1%  12.7K-1%0201  [0201]
RT1  33K 1%  33K-1%0201  [0201]
VO3  DNI  TP-ROUND  [TP-ROUND]
VO5A  DNI  TP-ROUND  [TP-ROUND]
VO5B  DNI  TP-ROUND  [TP-ROUND]

### Nets
3V3_EN_SYS1: IC40.6(EN) R241.2
5V_EN: IC41.6(EN) IC43.6(EN) R287.2 R289.1 R296.2 R298.1
5VFB: C295.2 R283.2 R284.2 R285.1
5VFB1: C302.2 R292.2 R293.2 R294.1
24VINA: F2.1_1 F2.1_2 J8.2
24VINB: F3.1_1 F3.1_2 J8.3
24VINC: F1.1_1 F1.1_2 J8.1
+3V3: C236.1 C238.1 C239.1 L11.2 RFB3.1 VO3.TP ; also sheet 1,2,3,4,6,7,8,9,10,11,12,13,14,15
+5VA: C264.1 C295.1 C297.1 C298.1 L12.2 R284.1 VO5A.TP ; also sheet 6
+5VB: C278.1 C302.1 C304.1 L13.2 R293.1 VO5B.TP ; also sheet 7
+24V_A: C256.1(+) C257.1(+) D11.C F3.2_1 F3.2_2 ; supply symbol labelled +24VA ; also sheet 8,9,10,11
+24V_B: C254.1(+) C255.1(+) D10.C F2.2_1 F2.2_2 ; supply symbol labelled +24VB ; also sheet 12,13,14,15
+24V_C: C233.1 C237.1 C252.1(+) C253.1(+) C292.1 C296.1 C299.1 C303.1 D9.C F1.2_1 F1.2_2 IC40.2(IN) IC41.2(IN) IC43.2(IN) R241.1 R289.2 R298.2 ; supply symbol labelled +24VC
GND: C233.2 C234.2 C237.2 C238.2 C239.2 C252.2(-) C253.2(-) C254.2(-) C255.2(-) C256.2(-) C257.2(-) C264.2 C278.2 C292.2 C293.2 C296.2 C297.2 C298.2 C299.2 C300.2 C303.2 C304.2 D9.A D10.A D11.A GND-1.TP GND-5.TP IC40.4(GND) IC41.4(GND) IC43.4(GND) J8.4 J8.5 J8.6 R242.2 R281.2 R285.2 R287.1 R290.2 R294.2 R296.1 RFB4.2 ; also sheet 1,2,3,4,6,7,8,9,10,11,12,13,14,15
N$16: IC41.5(BST) R282.2
N$17: IC41.8(FB) R283.1
N$18: C294.1 R282.1
N$20: C293.1 IC41.7(VCC) R286.1
N$39: IC41.1(AAM) R281.1 R286.2
N$41: IC43.5(BST) R291.2
N$55: IC43.8(FB) R292.1
N$57: C301.1 R291.1
N$68: C300.1 IC43.7(VCC) R295.1
N$69: IC43.1(AAM) R290.1 R295.2
N$267: IC40.5(BST) R243.2
N$268: IC40.8(FB) RT1.1
N$270: C235.1 R243.1
N$271: C236.2 RFB3.2 RFB4.1 RT1.2
N$275: C234.1 IC40.7(VCC) R244.1
N$276: IC40.1(AAM) R242.1 R244.2
SW1: C301.2 IC43.3(SW) L13.1
SW3: C235.2 IC40.3(SW) L11.1
SW5: C294.2 IC41.3(SW) L12.1

### Notes on the sheet
- 3.3V DC-DC CONVERTER | EXT 24VDC INPUT
- Vin = 4.5-24V
- VOUT = 0.791 × (1 + RFB1/RFB2), RFB1 = 40.2k
  
  For 3.3V VTG (VOUT = 3.3V):
     RFB2 = 40.2 / ((3.3 / 0.791) - 1) ≈ 12.7k
- FUSE BLOCK | LOAD COVERED | MAX CURRENT @24V | FUSE
- F1 | 4x USB-C (TPS552882) | ~11.1 A | 15 A slow-blow blade
- F2 | 4x USB-C (TPS552882) | ~11.1 A | 15 A slow-blow blade
- F3
- 4x USB-A (MP2315S) 
  + 3.3V System
- ~1.5 A | 2 A slow-blow blade
- 5V DC-DC CONVERTER
- VOUT (V) | RFB1 (kΩ) | RFB2 (kΩ) | RT (kΩ)
- 1.05 | 20.5 | 62.0 | 100.0
- 1.2 | 20.5 | 39.2 | 75.0
- 1.8 | 40.2 | 31.6 | 59.0
- ETHERNET CONTROLLER
- 2.5 | 40.2 | 18.7 | 40.2
- 3.3 | 40.2 | 12.7 | 33.0
- 5.0 | 40.2 | 7.5 | 20.0

## Sheet 6 of 15: USB-A SOURCE PORT1-2
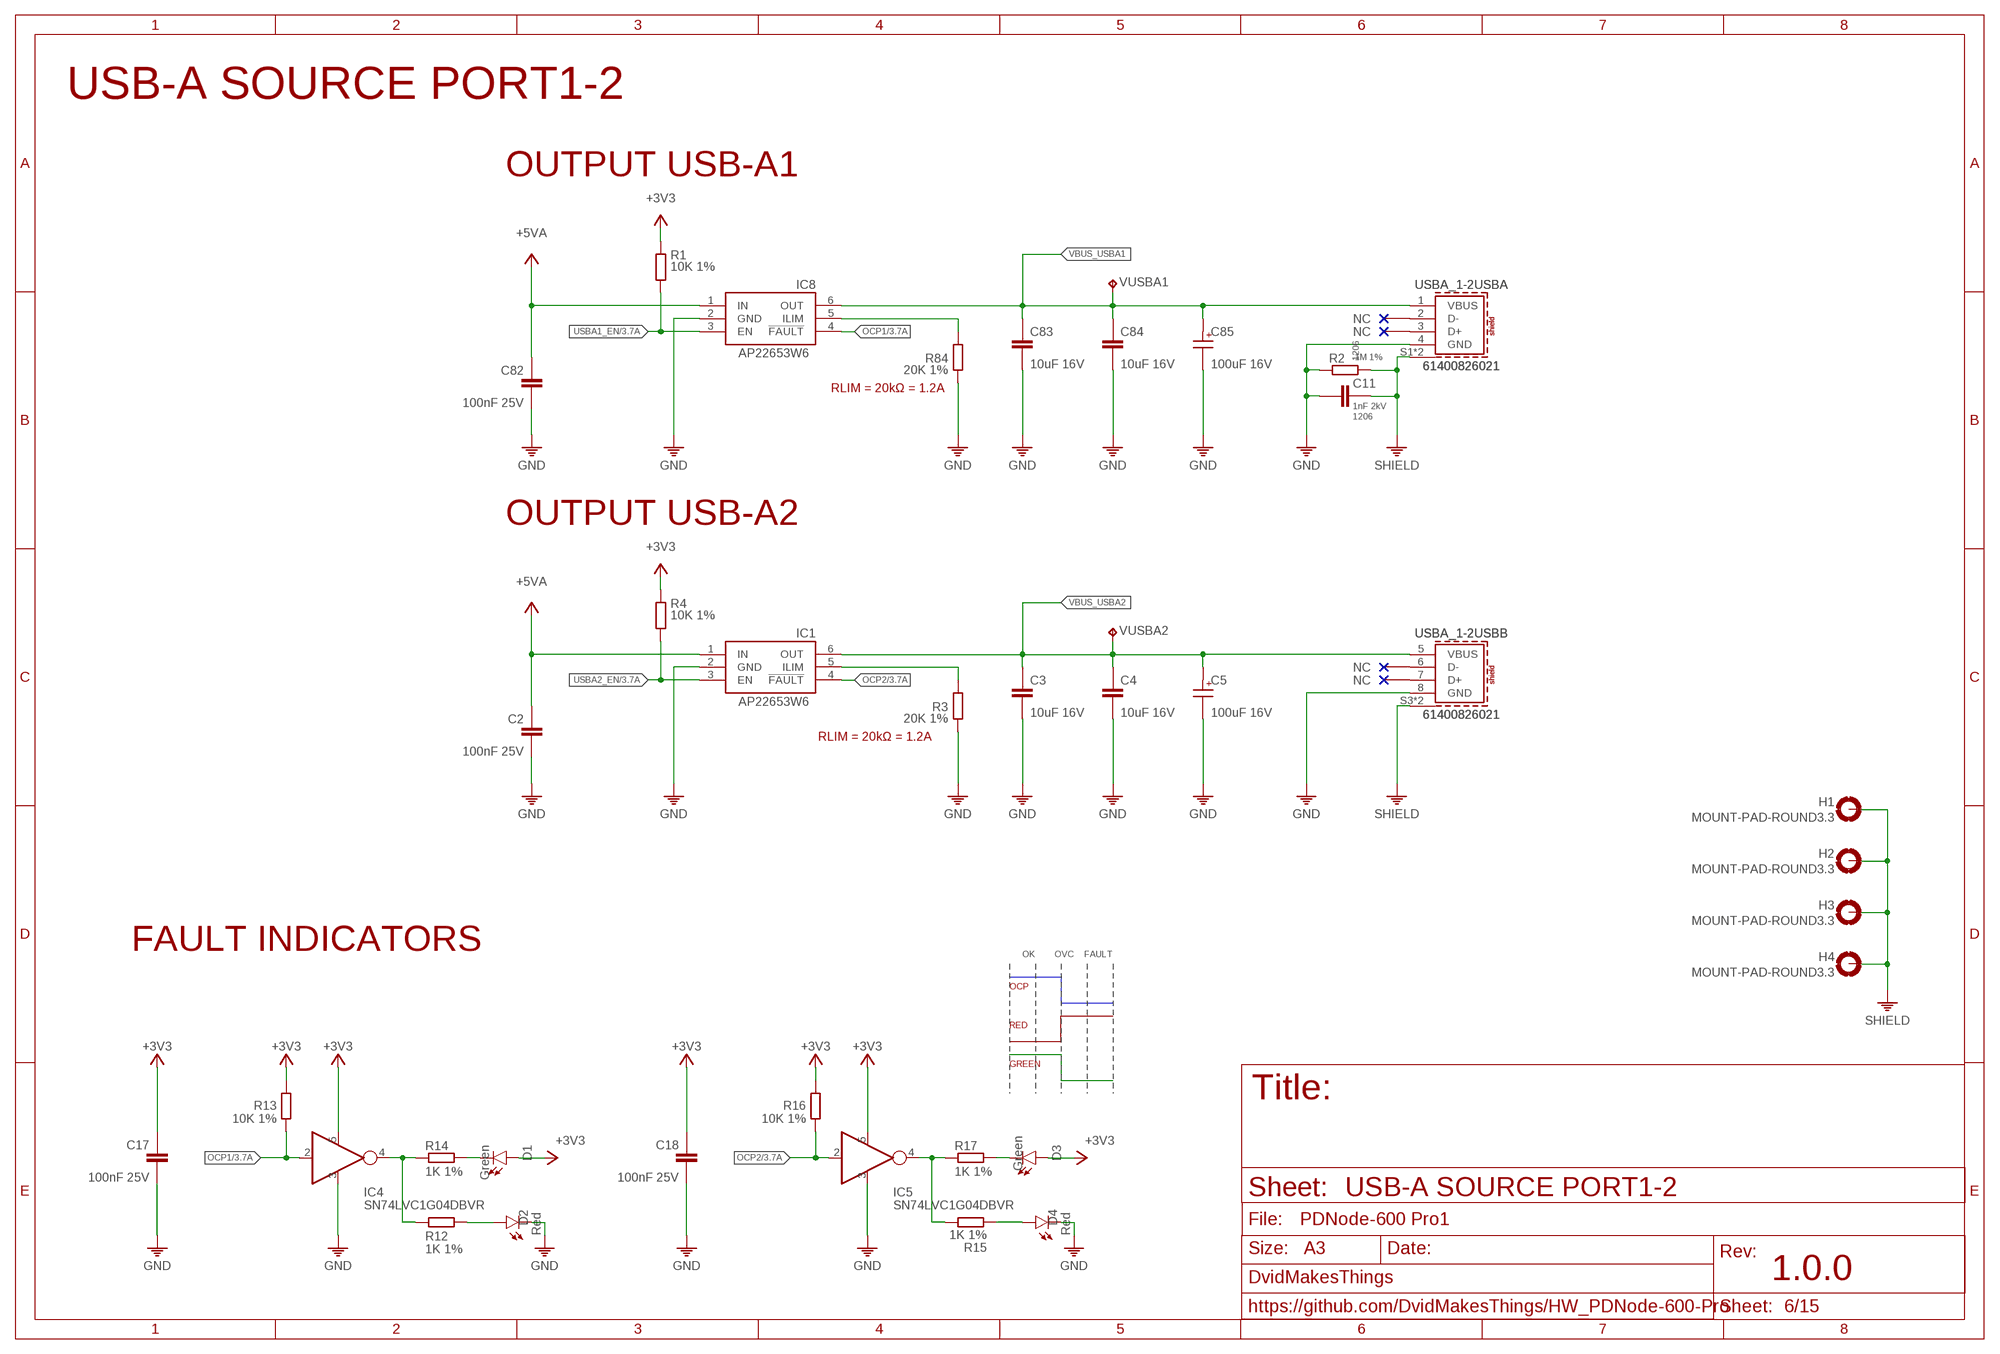
[diagram p5: schematic, sheet 6]

### Parts
C2  100nF 25V  100NF-25V-0201  [0201]
C3  10uF 16V  10UF-16V-0603  [0603]
C4  10uF 16V  10UF-16V-0603  [0603]
C5  100uF 16V  100UF-16V5X5.5(DXL)  [5X5.5(DXL)]
C11  1nF 2kV  1NF-2KV  [1206]
C17  100nF 25V  100NF-25V-0201  [0201]
C18  100nF 25V  100NF-25V-0201  [0201]
C82  100nF 25V  100NF-25V-0201  [0201]
C83  10uF 16V  10UF-16V-0603  [0603]
C84  10uF 16V  10UF-16V-0603  [0603]
C85  100uF 16V  100UF-16V5X5.5(DXL)  [5X5.5(DXL)]
D1  Green  LED-GREENLED-0603  [LED-0603]
D2  Red  LED-REDLED-0603  [LED-0603]
D3  Green  LED-GREENLED-0603  [LED-0603]
D4  Red  LED-REDLED-0603  [LED-0603]
H1  MOUNT-PAD-ROUND3.3  [3,3-PAD]
H2  MOUNT-PAD-ROUND3.3  [3,3-PAD]
H3  MOUNT-PAD-ROUND3.3  [3,3-PAD]
H4  MOUNT-PAD-ROUND3.3  [3,3-PAD]
IC1  AP22653W6  [SOT23-6]
IC4  SN74LVC1G04DBVR  74LVC1G04  [SOT95P280X145-5N]
IC5  SN74LVC1G04DBVR  74LVC1G04  [SOT95P280X145-5N]
IC8  AP22653W6  [SOT23-6]
R1  10K 1%  10K-1%0201  [0201]
R2  1M 1%  1M-1%1206  [1206]
R3  20K 1%  20K-1%0201  [0201]
R4  10K 1%  10K-1%0201  [0201]
R12  1K 1%  1K-1%0402  [0402]
R13  10K 1%  10K-1%0402  [0402]
R14  1K 1%  1K-1%0402  [0402]
R15  1K 1%  1K-1%0402  [0402]
R16  10K 1%  10K-1%0402  [0402]
R17  1K 1%  1K-1%0402  [0402]
R84  20K 1%  20K-1%0201  [0201]
USBA_1-2  61400826021  [61400826021]
VUSBA1  TPB1,27  [B1,27]
VUSBA2  TPB1,27  [B1,27]

### Nets
+3V3: C17.1 C18.1 D1.A D3.A IC4.5(V+) IC5.5(V+) R1.1 R4.1 R13.2 R16.2 ; also sheet 1,2,3,4,5,7,8,9,10,11,12,13,14,15
+5VA: C2.1 C82.1 IC1.1(IN) IC8.1(IN) ; also sheet 5
GND: C2.2 C3.2 C4.2 C5.2(-) C11.2 C17.2 C18.2 C82.2 C83.2 C84.2 C85.2(-) D2.C D4.C IC1.2(GND) IC4.3(V-) IC5.3(V-) IC8.2(GND) R2.1 R3.2 R84.2 USBA_1-2.4(USBA:GND) USBA_1-2.8(USBB:GND) ; also sheet 1,2,3,4,5,7,8,9,10,11,12,13,14,15
N$1: IC1.5(ILIM) R3.1
N$4: D2.A R12.2
N$5: IC4.4(OUT) R12.1 R14.1
N$6: D1.C R14.2
N$7: D4.A R15.1
N$8: IC5.4(OUT) R15.2 R17.1
N$9: D3.C R17.2
N$46: IC8.5(ILIM) R84.1
OCP1: IC4.2(IN) IC8.4(!FAULT) R13.1 ; also sheet 3
OCP2: IC1.4(!FAULT) IC5.2(IN) R16.1 ; also sheet 3
SHIELD: C11.1 H1.B3,3(MOUNT) H2.B3,3(MOUNT) H3.B3,3(MOUNT) H4.B3,3(MOUNT) R2.2 USBA_1-2.S1(USBA:SHIELD) USBA_1-2.S2(USBA:SHIELD) USBA_1-2.S3(USBB:SHIELD) USBA_1-2.S4(USBB:SHIELD) ; also sheet 3,4,7,8,9,10,11,12,13,14,15
USBA1_EN: IC8.3(EN) R1.2 ; also sheet 3
USBA2_EN: IC1.3(EN) R4.2 ; also sheet 3
VBUS_USBA1: C83.1 C84.1 C85.1(+) IC8.6(OUT) USBA_1-2.1(USBA:VBUS) VUSBA1.TP
VBUS_USBA2: C3.1 C4.1 C5.1(+) IC1.6(OUT) USBA_1-2.5(USBB:VBUS) VUSBA2.TP
Unconnected: USBA_1-2.2(USBA:D-) USBA_1-2.3(USBA:D+) USBA_1-2.6(USBB:D-) USBA_1-2.7(USBB:D+)

### Notes on the sheet
- USB-A SOURCE PORT1-2
- OUTPUT USB-A1
- RLIM = 20kΩ = 1.2A
- OUTPUT USB-A2
- RLIM = 20kΩ = 1.2A
- FAULT INDICATORS | OK | OVC | FAULT
- OCP
- RED
- GREEN
- USB-A SOURCE PORT1-2

## Sheet 7 of 15: USB-A SOURCE PORT3-4
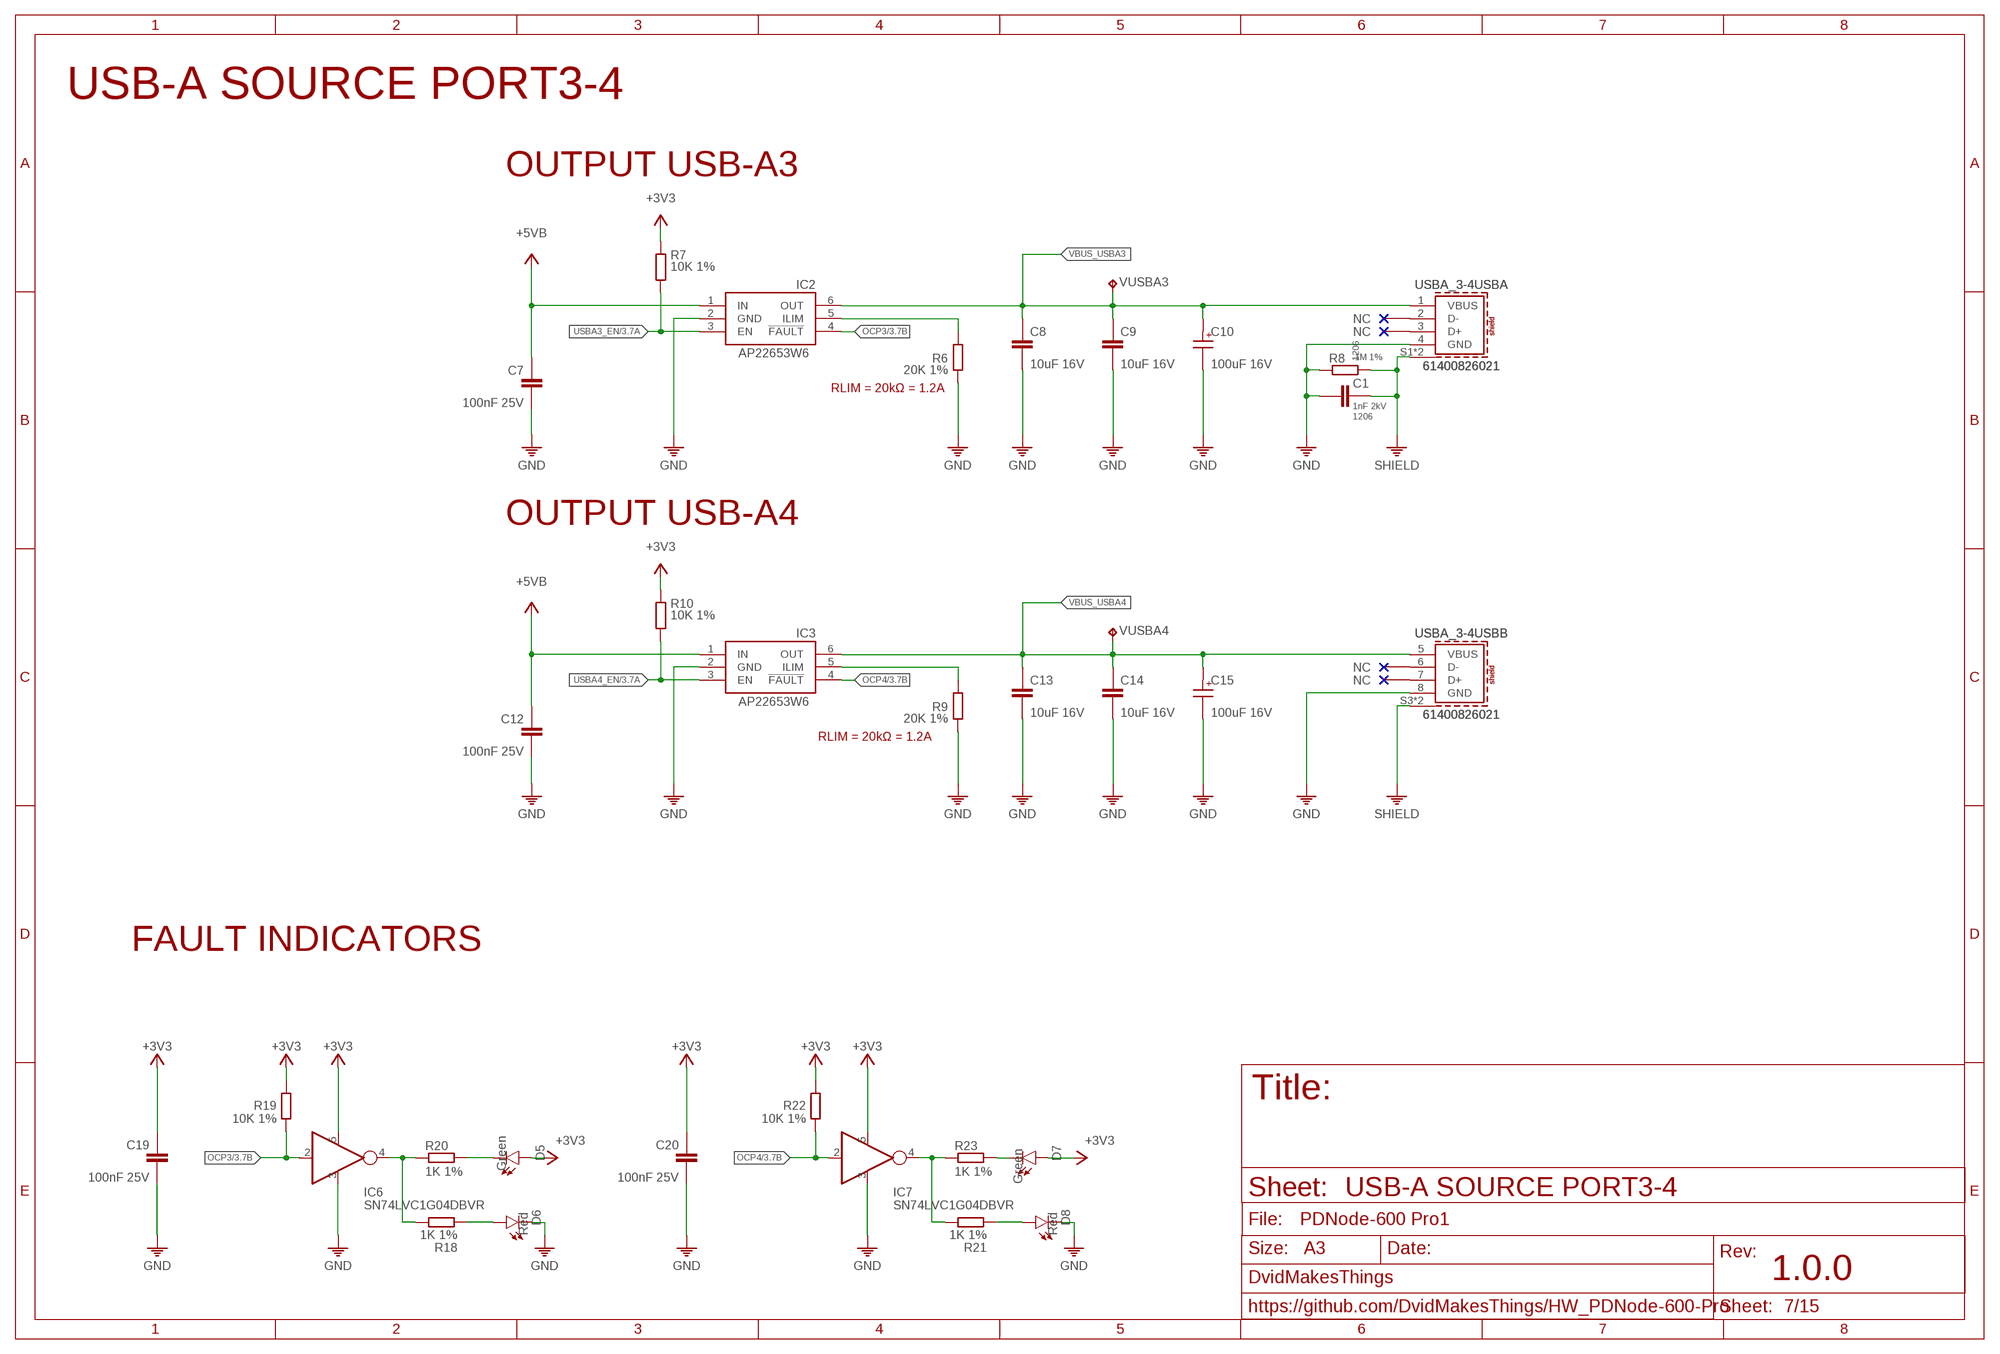
[diagram p6: schematic, sheet 7]

### Parts
C1  1nF 2kV  1NF-2KV  [1206]
C7  100nF 25V  100NF-25V-0201  [0201]
C8  10uF 16V  10UF-16V-0603  [0603]
C9  10uF 16V  10UF-16V-0603  [0603]
C10  100uF 16V  100UF-16V5X5.5(DXL)  [5X5.5(DXL)]
C12  100nF 25V  100NF-25V-0201  [0201]
C13  10uF 16V  10UF-16V-0603  [0603]
C14  10uF 16V  10UF-16V-0603  [0603]
C15  100uF 16V  100UF-16V5X5.5(DXL)  [5X5.5(DXL)]
C19  100nF 25V  100NF-25V-0201  [0201]
C20  100nF 25V  100NF-25V-0201  [0201]
D5  Green  LED-GREENLED-0603  [LED-0603]
D6  Red  LED-REDLED-0603  [LED-0603]
D7  Green  LED-GREENLED-0603  [LED-0603]
D8  Red  LED-REDLED-0603  [LED-0603]
IC2  AP22653W6  [SOT23-6]
IC3  AP22653W6  [SOT23-6]
IC6  SN74LVC1G04DBVR  74LVC1G04  [SOT95P280X145-5N]
IC7  SN74LVC1G04DBVR  74LVC1G04  [SOT95P280X145-5N]
R6  20K 1%  20K-1%0201  [0201]
R7  10K 1%  10K-1%0201  [0201]
R8  1M 1%  1M-1%1206  [1206]
R9  20K 1%  20K-1%0201  [0201]
R10  10K 1%  10K-1%0201  [0201]
R18  1K 1%  1K-1%0402  [0402]
R19  10K 1%  10K-1%0402  [0402]
R20  1K 1%  1K-1%0402  [0402]
R21  1K 1%  1K-1%0402  [0402]
R22  10K 1%  10K-1%0402  [0402]
R23  1K 1%  1K-1%0402  [0402]
USBA_3-4  61400826021  [61400826021]
VUSBA3  TPB1,27  [B1,27]
VUSBA4  TPB1,27  [B1,27]

### Nets
+3V3: C19.1 C20.1 D5.A D7.A IC6.5(V+) IC7.5(V+) R7.1 R10.1 R19.2 R22.2 ; also sheet 1,2,3,4,5,6,8,9,10,11,12,13,14,15
+5VB: C7.1 C12.1 IC2.1(IN) IC3.1(IN) ; also sheet 5
GND: C1.2 C7.2 C8.2 C9.2 C10.2(-) C12.2 C13.2 C14.2 C15.2(-) C19.2 C20.2 D6.C D8.C IC2.2(GND) IC3.2(GND) IC6.3(V-) IC7.3(V-) R6.2 R8.1 R9.2 USBA_3-4.4(USBA:GND) USBA_3-4.8(USBB:GND) ; also sheet 1,2,3,4,5,6,8,9,10,11,12,13,14,15
N$2: IC2.5(ILIM) R6.1
N$3: IC3.5(ILIM) R9.1
N$10: D6.A R18.1
N$11: IC6.4(OUT) R18.2 R20.1
N$12: D5.C R20.2
N$13: D8.A R21.1
N$14: IC7.4(OUT) R21.2 R23.1
N$15: D7.C R23.2
OCP3: IC2.4(!FAULT) IC6.2(IN) R19.1 ; also sheet 3
OCP4: IC3.4(!FAULT) IC7.2(IN) R22.1 ; also sheet 3
SHIELD: C1.1 R8.2 USBA_3-4.S1(USBA:SHIELD) USBA_3-4.S2(USBA:SHIELD) USBA_3-4.S3(USBB:SHIELD) USBA_3-4.S4(USBB:SHIELD) ; also sheet 3,4,6,8,9,10,11,12,13,14,15
USBA3_EN: IC2.3(EN) R7.2 ; also sheet 3
USBA4_EN: IC3.3(EN) R10.2 ; also sheet 3
VBUS_USBA3: C8.1 C9.1 C10.1(+) IC2.6(OUT) USBA_3-4.1(USBA:VBUS) VUSBA3.TP
VBUS_USBA4: C13.1 C14.1 C15.1(+) IC3.6(OUT) USBA_3-4.5(USBB:VBUS) VUSBA4.TP
Unconnected: USBA_3-4.2(USBA:D-) USBA_3-4.3(USBA:D+) USBA_3-4.6(USBB:D-) USBA_3-4.7(USBB:D+)

### Notes on the sheet
- USB-A SOURCE PORT3-4
- OUTPUT USB-A3
- RLIM = 20kΩ = 1.2A
- OUTPUT USB-A4
- RLIM = 20kΩ = 1.2A
- FAULT INDICATORS
- USB-A SOURCE PORT3-4

## Sheet 8 of 15: USB-C PD SOURCE PORT1
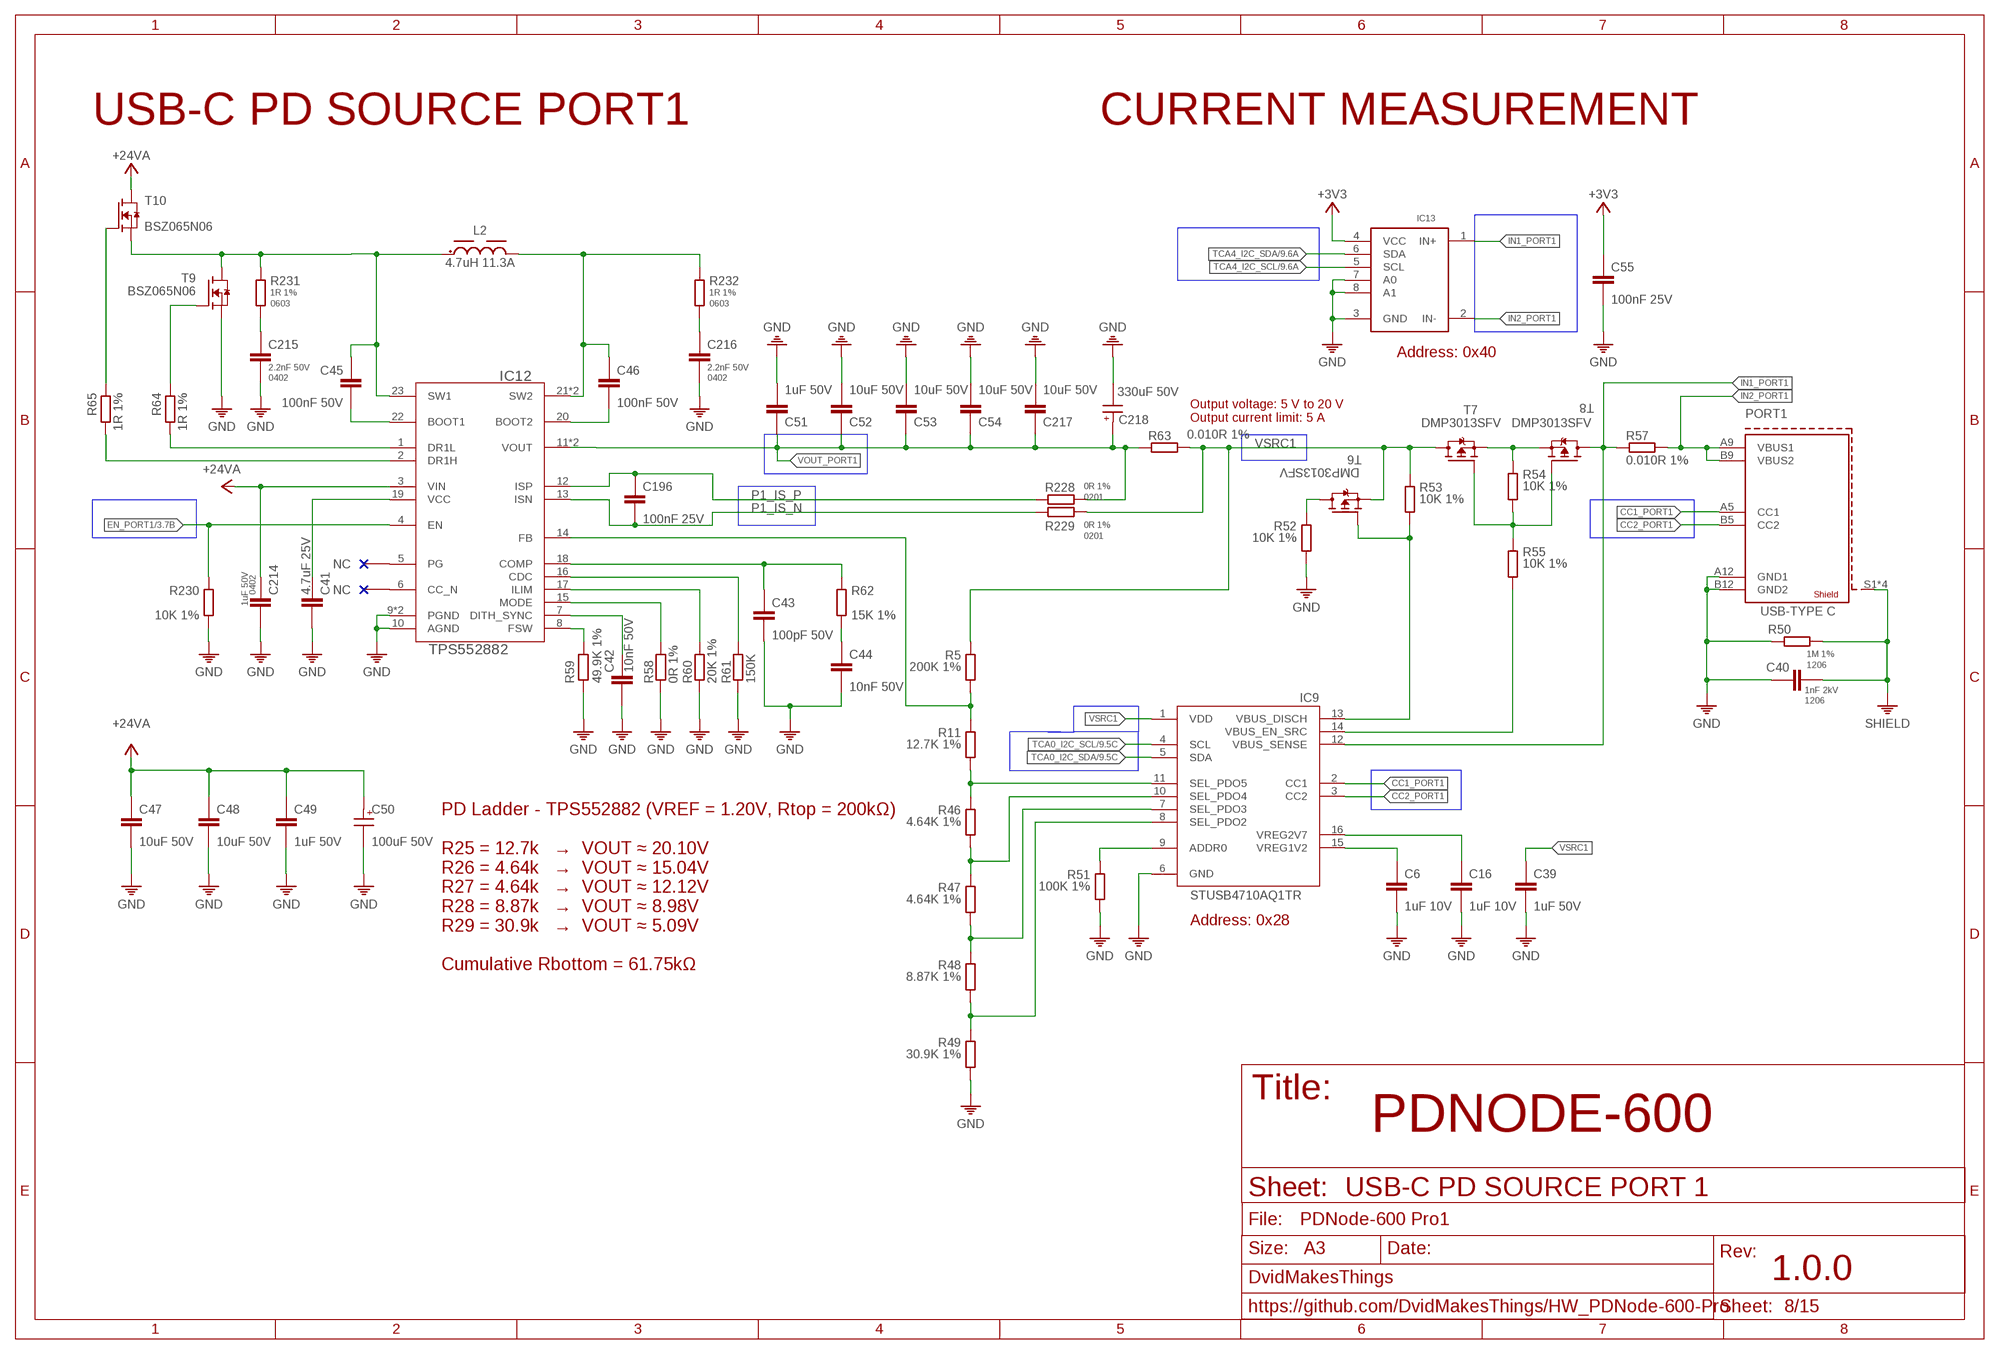
[diagram p7: schematic, sheet 8]

### Parts
C6  1uF 10V  1UF-10V0201  [0201]
C16  1uF 10V  1UF-10V0201  [0201]
C39  1uF 50V  1UF-50V0603  [0603]
C40  1nF 2kV  1NF-2KV  [1206]
C41  4.7uF 25V  4.7UF-25V0402  [0402]
C42  10nF 50V  10NF-50V-0201  [0201]
C43  100pF 50V  100PF-50V0201  [0201]
C44  10nF 50V  10NF-50V-0201  [0201]
C45  100nF 50V  100NF-50V-0402  [0402]
C46  100nF 50V  100NF-50V-0402  [0402]
C47  10uF 50V  10UF-50V-0805  [0805]
C48  10uF 50V  10UF-50V-0805  [0805]
C49  1uF 50V  1UF-50V0805  [0805]
C50  100uF 50V  100UF-50V6.3X7.7(DXL)  [6.3X7.7(DXL)]
C51  1uF 50V  1UF-50V0402  [0402]
C52  10uF 50V  10UF-50V-0805  [0805]
C53  10uF 50V  10UF-50V-0805  [0805]
C54  10uF 50V  10UF-50V-0805  [0805]
C55  100nF 25V  100NF-25V-0201  [0201]
C196  100nF 25V  100NF-25V-0201  [0201]
C214  1uF 50V  1UF-50V0402  [0402]
C215  2.2nF 50V  2.2NF-50V-0402  [0402]
C216  2.2nF 50V  2.2NF-50V-0402  [0402]
C217  10uF 50V  10UF-50V-0805  [0805]
C218  330uF 50V  330UF-50V10X10.5(DXL)  [10X10.5(DXL)]
IC9  STUSB4710AQ1TR  [QFN50P300X300X55-16N]
IC12  TPS552882  [RPM0026A-MFG]
IC13  INA219BIDCNT  [SOT23-8]
L2  4.7uH 11.3A  4.7UH-PWR  [WE-PDHV_1280]
PORT1  632722100213  USB-C-POWERONLY  [632722100213]
R5  200K 1%  200K-1%0201  [0201]
R11  12.7K 1%  12.7K-1%0201  [0201]
R46  4.64K 1%  4.64K-1%-0201  [0201]
R47  4.64K 1%  4.64K-1%-0201  [0201]
R48  8.87K 1%  8.87K-1%-0201  [0201]
R49  30.9K 1%  30.9K-1%0201  [0201]
R50  1M 1%  1M-1%1206  [1206]
R51  100K 1%  100K-1%0201  [0201]
R52  10K 1%  10K-1%0402  [0402]
R53  10K 1%  10K-1%0402  [0402]
R54  10K 1%  10K-1%0201  [0201]
R55  10K 1%  10K-1%0402  [0402]
R57  0.010R 1%  0.010R-1%-2512  [2512]
R58  0R 1%  0R0201  [0201]
R59  49.9K 1%  49.9K-1%0201  [0201]
R60  20K 1%  20K-1%0201  [0201]
R61  150K  R0201  [R0201]
R62  15K 1%  15K-1%0201  [0201]
R63  0.010R 1%  0.010R-1%-2512  [2512]
R64  1R 1%  1R-1%0402  [0402]
R65  1R 1%  1R-1%0402  [0402]
R228  0R 1%  0R0201  [0201]
R229  0R 1%  0R0201  [0201]
R230  10K 1%  10K-1%0201  [0201]
R231  1R 1%  1R-1%0603  [0603]
R232  1R 1%  1R-1%0603  [0603]
T6  DMP3013SFV  DMP3013SFV-7UX  [POWERDI3333-8_UX_DIO-L]
T7  DMP3013SFV  DMP3013SFV-7UX  [POWERDI3333-8_UX_DIO-L]
T8  DMP3013SFV  DMP3013SFV-7UX  [POWERDI3333-8_UX_DIO-L]
T9  BSZ065N06  IPZ40N04S5L7R4ATMA1  [POWERDI3333-8_UX_DIO-L]
T10  BSZ065N06  IPZ40N04S5L7R4ATMA1  [POWERDI3333-8_UX_DIO-L]

### Nets
+3V3: C55.1 IC13.4(VCC) ; also sheet 1,2,3,4,5,6,7,9,10,11,12,13,14,15
+24V_A: C47.1 C48.1 C49.1 C50.1(+) C214.1 IC12.3(VIN) T10.5(D) T10.6(D) T10.7(D) T10.8(D) T10.9(D) ; supply symbol labelled +24VA ; also sheet 5,9,10,11
CC1_PORT1: IC9.2(CC1) PORT1.A5(CC1)
CC2_PORT1: IC9.3(CC2) PORT1.B5(CC2)
DISCHARGE1: R52.1 T6.5(D) T6.6(D) T6.7(D) T6.8(D) T6.9(D)
EN_PORT1: IC12.4(EN) R230.1 ; also sheet 3
GND: C6.2 C16.2 C39.2 C40.1 C41.2 C42.2 C43.2 C44.2 C47.2 C48.2 C49.2 C50.2(-) C51.2 C52.2 C53.2 C54.2 C55.2 C214.2 C215.2 C216.2 C217.2 C218.2(-) IC9.6(GND) IC12.9(PGND) IC12.10(AGND) IC12.24(PGND) IC13.3(GND) IC13.7(A0) IC13.8(A1) PORT1.A12(GND1) PORT1.B12(GND2) R49.2 R50.1 R51.2 R52.2 R58.2 R59.2 R60.2 R61.2 R230.2 T9.1(S) T9.2(S) T9.3(S) ; also sheet 1,2,3,4,5,6,7,9,10,11,12,13,14,15
IN1_PORT1: IC9.12(VBUS_SENSE) IC13.1(IN+) R57.1 T8.5(D) T8.6(D) T8.7(D) T8.8(D) T8.9(D)
IN2_PORT1: IC13.2(IN-) PORT1.A9(VBUS1) PORT1.B9(VBUS2) R57.2
IND1: C45.1 IC12.23(SW1) L2.1 R231.1 T9.5(D) T9.6(D) T9.7(D) T9.8(D) T9.9(D) T10.1(S) T10.2(S) T10.3(S)
INDOUT1: C46.1 IC12.21(SW2) IC12.25(SW2) L2.2 R232.1
N$31: IC12.14(FB) R5.2 R11.1
N$33: C215.1 R231.2
N$34: C216.1 R232.2
N$48: IC9.11(SEL_PDO5) R11.2 R46.1
N$49: IC9.10(SEL_PDO4) R46.2 R47.1
N$50: IC9.7(SEL_PDO3) R47.2 R48.1
N$51: IC9.8(SEL_PDO2) R48.2 R49.1
N$52: C6.1 IC9.15(VREG1V2)
N$53: C16.1 IC9.16(VREG2V7)
N$54: IC9.9(ADDR0) R51.1
N$56: IC9.13(VBUS_DISCH) R53.2 T6.4(G)
N$58: R54.2 R55.1 T7.4(G) T8.4(G)
N$59: IC9.14(VBUS_EN_SRC) R55.2
N$60: C44.1 R62.2
N$61: IC12.8(FSW) R59.1
N$62: C42.1 IC12.7(DITH_SYNC)
N$63: IC12.15(MODE) R58.1
N$64: IC12.17(ILIM) R60.1
N$65: IC12.16(CDC) R61.1
N$66: C43.1 IC12.18(COMP) R62.1
N$67: C41.1 IC12.19(VCC)
N$70: C45.2 IC12.22(BOOT1)
N$71: C46.2 IC12.20(BOOT2)
N$72: R65.2 T10.4(G)
N$73: R64.2 T9.4(G)
N$74: IC12.1(DR1L) R64.1
N$75: IC12.2(DR1H) R65.1
P1_IS_N [50R_DIFFPAIR]: C196.2 IC12.13(ISN) R229.1
P1_IS_P [50R_DIFFPAIR]: C196.1 IC12.12(ISP) R228.1
SHIELD: C40.2 PORT1.S1(SHIELD1) PORT1.S2(SHIELD1) PORT1.S3(SHIELD1) PORT1.S4(SHIELD1) R50.2 ; also sheet 3,4,6,7,9,10,11,12,13,14,15
SOURCE1: R54.1 T7.1(S) T7.2(S) T7.3(S) T8.1(S) T8.2(S) T8.3(S)
TCA0_I2C_SCL: IC9.4(SCL) ; also sheet 3,9
TCA0_I2C_SDA: IC9.5(SDA) ; also sheet 3,9
TCA4_I2C_SCL: IC13.5(SCL) ; also sheet 3,9,10,11
TCA4_I2C_SDA: IC13.6(SDA) ; also sheet 3,9,10,11
VOUT_PORT1: C51.1 C52.1 C53.1 C54.1 C217.1 C218.1(+) IC12.11(VOUT) IC12.26(VOUT) R63.1 R228.2
VSRC1: C39.1 IC9.1(VDD) R5.1 R53.1 R63.2 R229.2 T6.1(S) T6.2(S) T6.3(S) T7.5(D) T7.6(D) T7.7(D) T7.8(D) T7.9(D)
Unconnected: IC12.5(PG) IC12.6(CC_N)

### Notes on the sheet
- USB-C PD SOURCE PORT1 | CURRENT MEASUREMENT
- Address: 0x40
- Output voltage: 5 V to 20 V
  Output current limit: 5 A
- Address: 0x28
- PD Ladder - TPS552882 (VREF = 1.20V, Rtop = 200kΩ)
  
  R25 = 12.7k   →  VOUT ≈ 20.10V
  R26 = 4.64k   →  VOUT ≈ 15.04V
  R27 = 4.64k   →  VOUT ≈ 12.12V
  R28 = 8.87k   →  VOUT ≈ 8.98V
  R29 = 30.9k   →  VOUT ≈ 5.09V
  
  Cumulative Rbottom = 61.75kΩ
- PDNODE-600
- USB-C PD SOURCE PORT 1

## Sheet 9 of 15: USB-C PD SOURCE PORT2
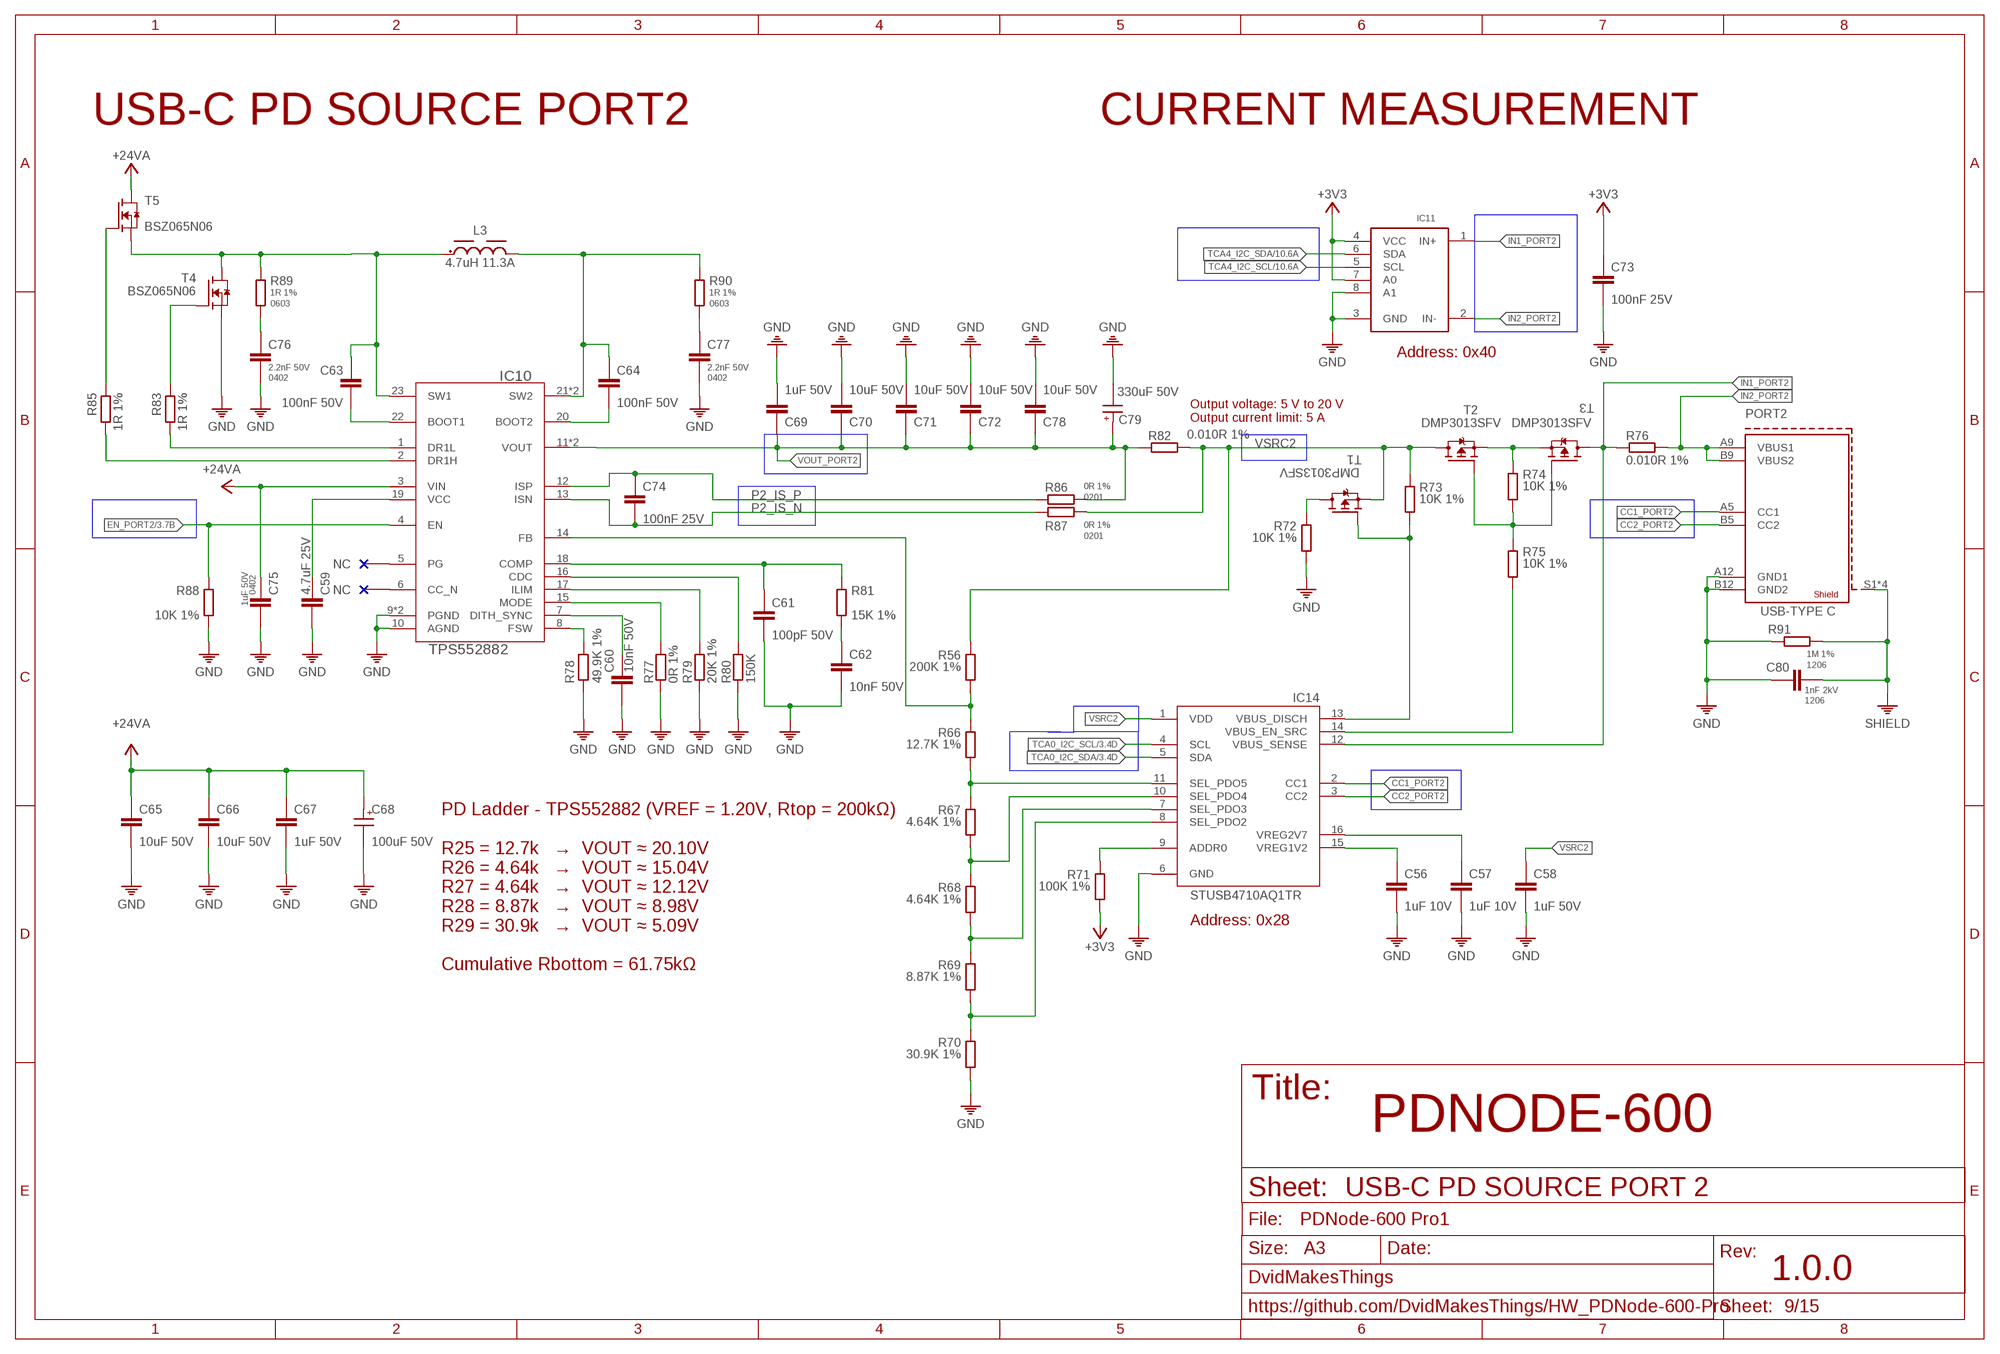
[diagram p8: schematic, sheet 9]

### Parts
C56  1uF 10V  1UF-10V0201  [0201]
C57  1uF 10V  1UF-10V0201  [0201]
C58  1uF 50V  1UF-50V0603  [0603]
C59  4.7uF 25V  4.7UF-25V0402  [0402]
C60  10nF 50V  10NF-50V-0201  [0201]
C61  100pF 50V  100PF-50V0201  [0201]
C62  10nF 50V  10NF-50V-0201  [0201]
C63  100nF 50V  100NF-50V-0402  [0402]
C64  100nF 50V  100NF-50V-0402  [0402]
C65  10uF 50V  10UF-50V-0805  [0805]
C66  10uF 50V  10UF-50V-0805  [0805]
C67  1uF 50V  1UF-50V0805  [0805]
C68  100uF 50V  100UF-50V6.3X7.7(DXL)  [6.3X7.7(DXL)]
C69  1uF 50V  1UF-50V0402  [0402]
C70  10uF 50V  10UF-50V-0805  [0805]
C71  10uF 50V  10UF-50V-0805  [0805]
C72  10uF 50V  10UF-50V-0805  [0805]
C73  100nF 25V  100NF-25V-0201  [0201]
C74  100nF 25V  100NF-25V-0201  [0201]
C75  1uF 50V  1UF-50V0402  [0402]
C76  2.2nF 50V  2.2NF-50V-0402  [0402]
C77  2.2nF 50V  2.2NF-50V-0402  [0402]
C78  10uF 50V  10UF-50V-0805  [0805]
C79  330uF 50V  330UF-50V10X10.5(DXL)  [10X10.5(DXL)]
C80  1nF 2kV  1NF-2KV  [1206]
IC10  TPS552882  [RPM0026A-MFG]
IC11  INA219BIDCNT  [SOT23-8]
IC14  STUSB4710AQ1TR  [QFN50P300X300X55-16N]
L3  4.7uH 11.3A  4.7UH-PWR  [WE-PDHV_1280]
PORT2  632722100213  USB-C-POWERONLY  [632722100213]
R56  200K 1%  200K-1%0201  [0201]
R66  12.7K 1%  12.7K-1%0201  [0201]
R67  4.64K 1%  4.64K-1%-0201  [0201]
R68  4.64K 1%  4.64K-1%-0201  [0201]
R69  8.87K 1%  8.87K-1%-0201  [0201]
R70  30.9K 1%  30.9K-1%0201  [0201]
R71  100K 1%  100K-1%0201  [0201]
R72  10K 1%  10K-1%0402  [0402]
R73  10K 1%  10K-1%0402  [0402]
R74  10K 1%  10K-1%0201  [0201]
R75  10K 1%  10K-1%0402  [0402]
R76  0.010R 1%  0.010R-1%-2512  [2512]
R77  0R 1%  0R0201  [0201]
R78  49.9K 1%  49.9K-1%0201  [0201]
R79  20K 1%  20K-1%0201  [0201]
R80  150K  R0201  [R0201]
R81  15K 1%  15K-1%0201  [0201]
R82  0.010R 1%  0.010R-1%-2512  [2512]
R83  1R 1%  1R-1%0402  [0402]
R85  1R 1%  1R-1%0402  [0402]
R86  0R 1%  0R0201  [0201]
R87  0R 1%  0R0201  [0201]
R88  10K 1%  10K-1%0201  [0201]
R89  1R 1%  1R-1%0603  [0603]
R90  1R 1%  1R-1%0603  [0603]
R91  1M 1%  1M-1%1206  [1206]
T1  DMP3013SFV  DMP3013SFV-7UX  [POWERDI3333-8_UX_DIO-L]
T2  DMP3013SFV  DMP3013SFV-7UX  [POWERDI3333-8_UX_DIO-L]
T3  DMP3013SFV  DMP3013SFV-7UX  [POWERDI3333-8_UX_DIO-L]
T4  BSZ065N06  IPZ40N04S5L7R4ATMA1  [POWERDI3333-8_UX_DIO-L]
T5  BSZ065N06  IPZ40N04S5L7R4ATMA1  [POWERDI3333-8_UX_DIO-L]

### Nets
+3V3: C73.1 IC11.4(VCC) IC11.7(A0) R71.2 ; also sheet 1,2,3,4,5,6,7,8,10,11,12,13,14,15
+24V_A: C65.1 C66.1 C67.1 C68.1(+) C75.1 IC10.3(VIN) T5.5(D) T5.6(D) T5.7(D) T5.8(D) T5.9(D) ; supply symbol labelled +24VA ; also sheet 5,8,10,11
CC1_PORT2: IC14.2(CC1) PORT2.A5(CC1)
CC2_PORT2: IC14.3(CC2) PORT2.B5(CC2)
DISCHARGE2: R72.1 T1.5(D) T1.6(D) T1.7(D) T1.8(D) T1.9(D)
EN_PORT2: IC10.4(EN) R88.1 ; also sheet 3
GND: C56.2 C57.2 C58.2 C59.2 C60.2 C61.2 C62.2 C65.2 C66.2 C67.2 C68.2(-) C69.2 C70.2 C71.2 C72.2 C73.2 C75.2 C76.2 C77.2 C78.2 C79.2(-) C80.1 IC10.9(PGND) IC10.10(AGND) IC10.24(PGND) IC11.3(GND) IC11.8(A1) IC14.6(GND) PORT2.A12(GND1) PORT2.B12(GND2) R70.2 R72.2 R77.2 R78.2 R79.2 R80.2 R88.2 R91.1 T4.1(S) T4.2(S) T4.3(S) ; also sheet 1,2,3,4,5,6,7,8,10,11,12,13,14,15
IN1_PORT2: IC11.1(IN+) IC14.12(VBUS_SENSE) R76.1 T3.5(D) T3.6(D) T3.7(D) T3.8(D) T3.9(D)
IN2_PORT2: IC11.2(IN-) PORT2.A9(VBUS1) PORT2.B9(VBUS2) R76.2
IND2: C63.1 IC10.23(SW1) L3.1 R89.1 T4.5(D) T4.6(D) T4.7(D) T4.8(D) T4.9(D) T5.1(S) T5.2(S) T5.3(S)
INDOUT2: C64.1 IC10.21(SW2) IC10.25(SW2) L3.2 R90.1
N$29: IC14.11(SEL_PDO5) R66.2 R67.1
N$30: IC14.10(SEL_PDO4) R67.2 R68.1
N$32: IC14.7(SEL_PDO3) R68.2 R69.1
N$35: IC14.8(SEL_PDO2) R69.2 R70.1
N$36: C56.1 IC14.15(VREG1V2)
N$37: C57.1 IC14.16(VREG2V7)
N$38: IC14.9(ADDR0) R71.1
N$40: IC14.13(VBUS_DISCH) R73.2 T1.4(G)
N$42: R74.2 R75.1 T2.4(G) T3.4(G)
N$44: IC14.14(VBUS_EN_SRC) R75.2
N$45: C62.1 R81.2
N$47: IC10.8(FSW) R78.1
N$76: C60.1 IC10.7(DITH_SYNC)
N$77: IC10.15(MODE) R77.1
N$78: IC10.17(ILIM) R79.1
N$79: IC10.16(CDC) R80.1
N$80: C61.1 IC10.18(COMP) R81.1
N$81: C59.1 IC10.19(VCC)
N$84: C63.2 IC10.22(BOOT1)
N$85: C64.2 IC10.20(BOOT2)
N$86: R85.2 T5.4(G)
N$87: R83.2 T4.4(G)
N$88: IC10.1(DR1L) R83.1
N$89: IC10.2(DR1H) R85.1
N$90: IC10.14(FB) R56.2 R66.1
N$91: C76.1 R89.2
N$92: C77.1 R90.2
P2_IS_N [50R_DIFFPAIR]: C74.2 IC10.13(ISN) R87.1
P2_IS_P [50R_DIFFPAIR]: C74.1 IC10.12(ISP) R86.1
SHIELD: C80.2 PORT2.S1(SHIELD1) PORT2.S2(SHIELD1) PORT2.S3(SHIELD1) PORT2.S4(SHIELD1) R91.2 ; also sheet 3,4,6,7,8,10,11,12,13,14,15
SOURCE2: R74.1 T2.1(S) T2.2(S) T2.3(S) T3.1(S) T3.2(S) T3.3(S)
TCA0_I2C_SCL: IC14.4(SCL) ; also sheet 3,8
TCA0_I2C_SDA: IC14.5(SDA) ; also sheet 3,8
TCA4_I2C_SCL: IC11.5(SCL) ; also sheet 3,8,10,11
TCA4_I2C_SDA: IC11.6(SDA) ; also sheet 3,8,10,11
VOUT_PORT2: C69.1 C70.1 C71.1 C72.1 C78.1 C79.1(+) IC10.11(VOUT) IC10.26(VOUT) R82.1 R86.2
VSRC2: C58.1 IC14.1(VDD) R56.1 R73.1 R82.2 R87.2 T1.1(S) T1.2(S) T1.3(S) T2.5(D) T2.6(D) T2.7(D) T2.8(D) T2.9(D)
Unconnected: IC10.5(PG) IC10.6(CC_N)

### Notes on the sheet
- USB-C PD SOURCE PORT2 | CURRENT MEASUREMENT
- Address: 0x40
- Output voltage: 5 V to 20 V
  Output current limit: 5 A
- Address: 0x28
- PD Ladder - TPS552882 (VREF = 1.20V, Rtop = 200kΩ)
  
  R25 = 12.7k   →  VOUT ≈ 20.10V
  R26 = 4.64k   →  VOUT ≈ 15.04V
  R27 = 4.64k   →  VOUT ≈ 12.12V
  R28 = 8.87k   →  VOUT ≈ 8.98V
  R29 = 30.9k   →  VOUT ≈ 5.09V
  
  Cumulative Rbottom = 61.75kΩ
- PDNODE-600
- USB-C PD SOURCE PORT 2

## Sheet 10 of 15: USB-C PD SOURCE PORT3
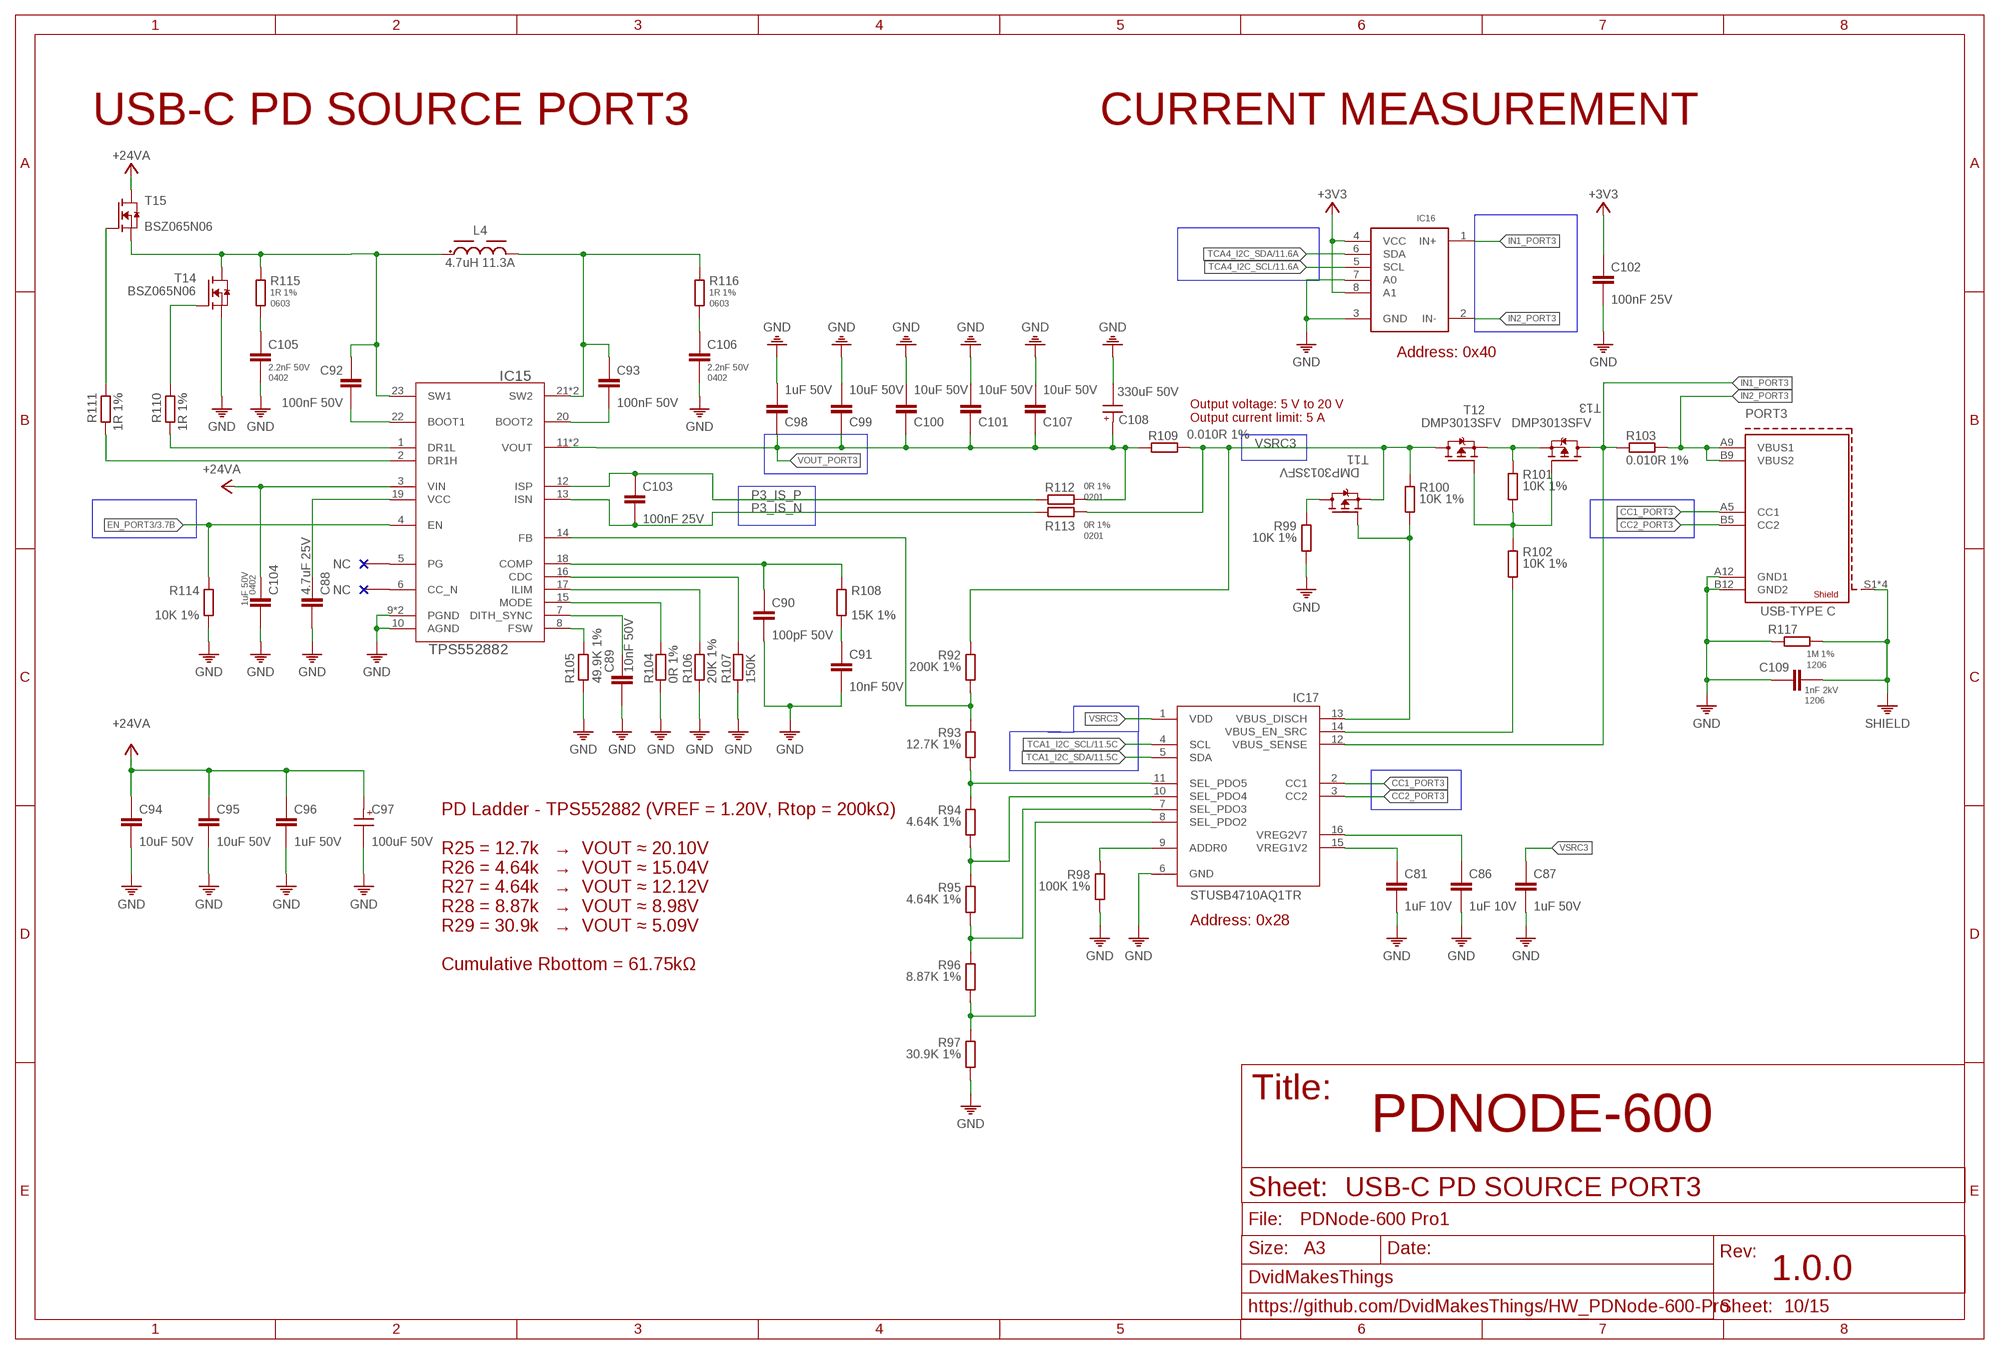
[diagram p9: schematic, sheet 10]

### Parts
C81  1uF 10V  1UF-10V0201  [0201]
C86  1uF 10V  1UF-10V0201  [0201]
C87  1uF 50V  1UF-50V0603  [0603]
C88  4.7uF 25V  4.7UF-25V0402  [0402]
C89  10nF 50V  10NF-50V-0201  [0201]
C90  100pF 50V  100PF-50V0201  [0201]
C91  10nF 50V  10NF-50V-0201  [0201]
C92  100nF 50V  100NF-50V-0402  [0402]
C93  100nF 50V  100NF-50V-0402  [0402]
C94  10uF 50V  10UF-50V-0805  [0805]
C95  10uF 50V  10UF-50V-0805  [0805]
C96  1uF 50V  1UF-50V0805  [0805]
C97  100uF 50V  100UF-50V6.3X7.7(DXL)  [6.3X7.7(DXL)]
C98  1uF 50V  1UF-50V0402  [0402]
C99  10uF 50V  10UF-50V-0805  [0805]
C100  10uF 50V  10UF-50V-0805  [0805]
C101  10uF 50V  10UF-50V-0805  [0805]
C102  100nF 25V  100NF-25V-0201  [0201]
C103  100nF 25V  100NF-25V-0201  [0201]
C104  1uF 50V  1UF-50V0402  [0402]
C105  2.2nF 50V  2.2NF-50V-0402  [0402]
C106  2.2nF 50V  2.2NF-50V-0402  [0402]
C107  10uF 50V  10UF-50V-0805  [0805]
C108  330uF 50V  330UF-50V10X10.5(DXL)  [10X10.5(DXL)]
C109  1nF 2kV  1NF-2KV  [1206]
IC15  TPS552882  [RPM0026A-MFG]
IC16  INA219BIDCNT  [SOT23-8]
IC17  STUSB4710AQ1TR  [QFN50P300X300X55-16N]
L4  4.7uH 11.3A  4.7UH-PWR  [WE-PDHV_1280]
PORT3  632722100213  USB-C-POWERONLY  [632722100213]
R92  200K 1%  200K-1%0201  [0201]
R93  12.7K 1%  12.7K-1%0201  [0201]
R94  4.64K 1%  4.64K-1%-0201  [0201]
R95  4.64K 1%  4.64K-1%-0201  [0201]
R96  8.87K 1%  8.87K-1%-0201  [0201]
R97  30.9K 1%  30.9K-1%0201  [0201]
R98  100K 1%  100K-1%0201  [0201]
R99  10K 1%  10K-1%0402  [0402]
R100  10K 1%  10K-1%0402  [0402]
R101  10K 1%  10K-1%0201  [0201]
R102  10K 1%  10K-1%0402  [0402]
R103  0.010R 1%  0.010R-1%-2512  [2512]
R104  0R 1%  0R0201  [0201]
R105  49.9K 1%  49.9K-1%0201  [0201]
R106  20K 1%  20K-1%0201  [0201]
R107  150K  R0201  [R0201]
R108  15K 1%  15K-1%0201  [0201]
R109  0.010R 1%  0.010R-1%-2512  [2512]
R110  1R 1%  1R-1%0402  [0402]
R111  1R 1%  1R-1%0402  [0402]
R112  0R 1%  0R0201  [0201]
R113  0R 1%  0R0201  [0201]
R114  10K 1%  10K-1%0201  [0201]
R115  1R 1%  1R-1%0603  [0603]
R116  1R 1%  1R-1%0603  [0603]
R117  1M 1%  1M-1%1206  [1206]
T11  DMP3013SFV  DMP3013SFV-7UX  [POWERDI3333-8_UX_DIO-L]
T12  DMP3013SFV  DMP3013SFV-7UX  [POWERDI3333-8_UX_DIO-L]
T13  DMP3013SFV  DMP3013SFV-7UX  [POWERDI3333-8_UX_DIO-L]
T14  BSZ065N06  IPZ40N04S5L7R4ATMA1  [POWERDI3333-8_UX_DIO-L]
T15  BSZ065N06  IPZ40N04S5L7R4ATMA1  [POWERDI3333-8_UX_DIO-L]

### Nets
+3V3: C102.1 IC16.4(VCC) IC16.8(A1) ; also sheet 1,2,3,4,5,6,7,8,9,11,12,13,14,15
+24V_A: C94.1 C95.1 C96.1 C97.1(+) C104.1 IC15.3(VIN) T15.5(D) T15.6(D) T15.7(D) T15.8(D) T15.9(D) ; supply symbol labelled +24VA ; also sheet 5,8,9,11
CC1_PORT3: IC17.2(CC1) PORT3.A5(CC1)
CC2_PORT3: IC17.3(CC2) PORT3.B5(CC2)
DISCHARGE3: R99.1 T11.5(D) T11.6(D) T11.7(D) T11.8(D) T11.9(D)
EN_PORT3: IC15.4(EN) R114.1 ; also sheet 3
GND: C81.2 C86.2 C87.2 C88.2 C89.2 C90.2 C91.2 C94.2 C95.2 C96.2 C97.2(-) C98.2 C99.2 C100.2 C101.2 C102.2 C104.2 C105.2 C106.2 C107.2 C108.2(-) C109.1 IC15.9(PGND) IC15.10(AGND) IC15.24(PGND) IC16.3(GND) IC16.7(A0) IC17.6(GND) PORT3.A12(GND1) PORT3.B12(GND2) R97.2 R98.2 R99.2 R104.2 R105.2 R106.2 R107.2 R114.2 R117.1 T14.1(S) T14.2(S) T14.3(S) ; also sheet 1,2,3,4,5,6,7,8,9,11,12,13,14,15
IN1_PORT3: IC16.1(IN+) IC17.12(VBUS_SENSE) R103.1 T13.5(D) T13.6(D) T13.7(D) T13.8(D) T13.9(D)
IN2_PORT3: IC16.2(IN-) PORT3.A9(VBUS1) PORT3.B9(VBUS2) R103.2
IND3: C92.1 IC15.23(SW1) L4.1 R115.1 T14.5(D) T14.6(D) T14.7(D) T14.8(D) T14.9(D) T15.1(S) T15.2(S) T15.3(S)
INDOUT3: C93.1 IC15.21(SW2) IC15.25(SW2) L4.2 R116.1
N$93: IC17.11(SEL_PDO5) R93.2 R94.1
N$94: IC17.10(SEL_PDO4) R94.2 R95.1
N$95: IC17.7(SEL_PDO3) R95.2 R96.1
N$96: IC17.8(SEL_PDO2) R96.2 R97.1
N$97: C81.1 IC17.15(VREG1V2)
N$98: C86.1 IC17.16(VREG2V7)
N$99: IC17.9(ADDR0) R98.1
N$101: IC17.13(VBUS_DISCH) R100.2 T11.4(G)
N$103: R101.2 R102.1 T12.4(G) T13.4(G)
N$104: IC17.14(VBUS_EN_SRC) R102.2
N$105: C91.1 R108.2
N$106: IC15.8(FSW) R105.1
N$107: C89.1 IC15.7(DITH_SYNC)
N$108: IC15.15(MODE) R104.1
N$109: IC15.17(ILIM) R106.1
N$110: IC15.16(CDC) R107.1
N$111: C90.1 IC15.18(COMP) R108.1
N$112: C88.1 IC15.19(VCC)
N$115: C92.2 IC15.22(BOOT1)
N$116: C93.2 IC15.20(BOOT2)
N$117: R111.2 T15.4(G)
N$118: R110.2 T14.4(G)
N$119: IC15.1(DR1L) R110.1
N$120: IC15.2(DR1H) R111.1
N$121: IC15.14(FB) R92.2 R93.1
N$122: C105.1 R115.2
N$123: C106.1 R116.2
P3_IS_N [50R_DIFFPAIR]: C103.2 IC15.13(ISN) R113.1
P3_IS_P [50R_DIFFPAIR]: C103.1 IC15.12(ISP) R112.1
SHIELD: C109.2 PORT3.S1(SHIELD1) PORT3.S2(SHIELD1) PORT3.S3(SHIELD1) PORT3.S4(SHIELD1) R117.2 ; also sheet 3,4,6,7,8,9,11,12,13,14,15
SOURCE3: R101.1 T12.1(S) T12.2(S) T12.3(S) T13.1(S) T13.2(S) T13.3(S)
TCA1_I2C_SCL: IC17.4(SCL) ; also sheet 3,11
TCA1_I2C_SDA: IC17.5(SDA) ; also sheet 3,11
TCA4_I2C_SCL: IC16.5(SCL) ; also sheet 3,8,9,11
TCA4_I2C_SDA: IC16.6(SDA) ; also sheet 3,8,9,11
VOUT_PORT3: C98.1 C99.1 C100.1 C101.1 C107.1 C108.1(+) IC15.11(VOUT) IC15.26(VOUT) R109.1 R112.2
VSRC3: C87.1 IC17.1(VDD) R92.1 R100.1 R109.2 R113.2 T11.1(S) T11.2(S) T11.3(S) T12.5(D) T12.6(D) T12.7(D) T12.8(D) T12.9(D)
Unconnected: IC15.5(PG) IC15.6(CC_N)

### Notes on the sheet
- USB-C PD SOURCE PORT3 | CURRENT MEASUREMENT
- Address: 0x40
- Output voltage: 5 V to 20 V
  Output current limit: 5 A
- Address: 0x28
- PD Ladder - TPS552882 (VREF = 1.20V, Rtop = 200kΩ)
  
  R25 = 12.7k   →  VOUT ≈ 20.10V
  R26 = 4.64k   →  VOUT ≈ 15.04V
  R27 = 4.64k   →  VOUT ≈ 12.12V
  R28 = 8.87k   →  VOUT ≈ 8.98V
  R29 = 30.9k   →  VOUT ≈ 5.09V
  
  Cumulative Rbottom = 61.75kΩ
- PDNODE-600
- USB-C PD SOURCE PORT3

## Sheet 11 of 15: USB-C PD SOURCE PORT4
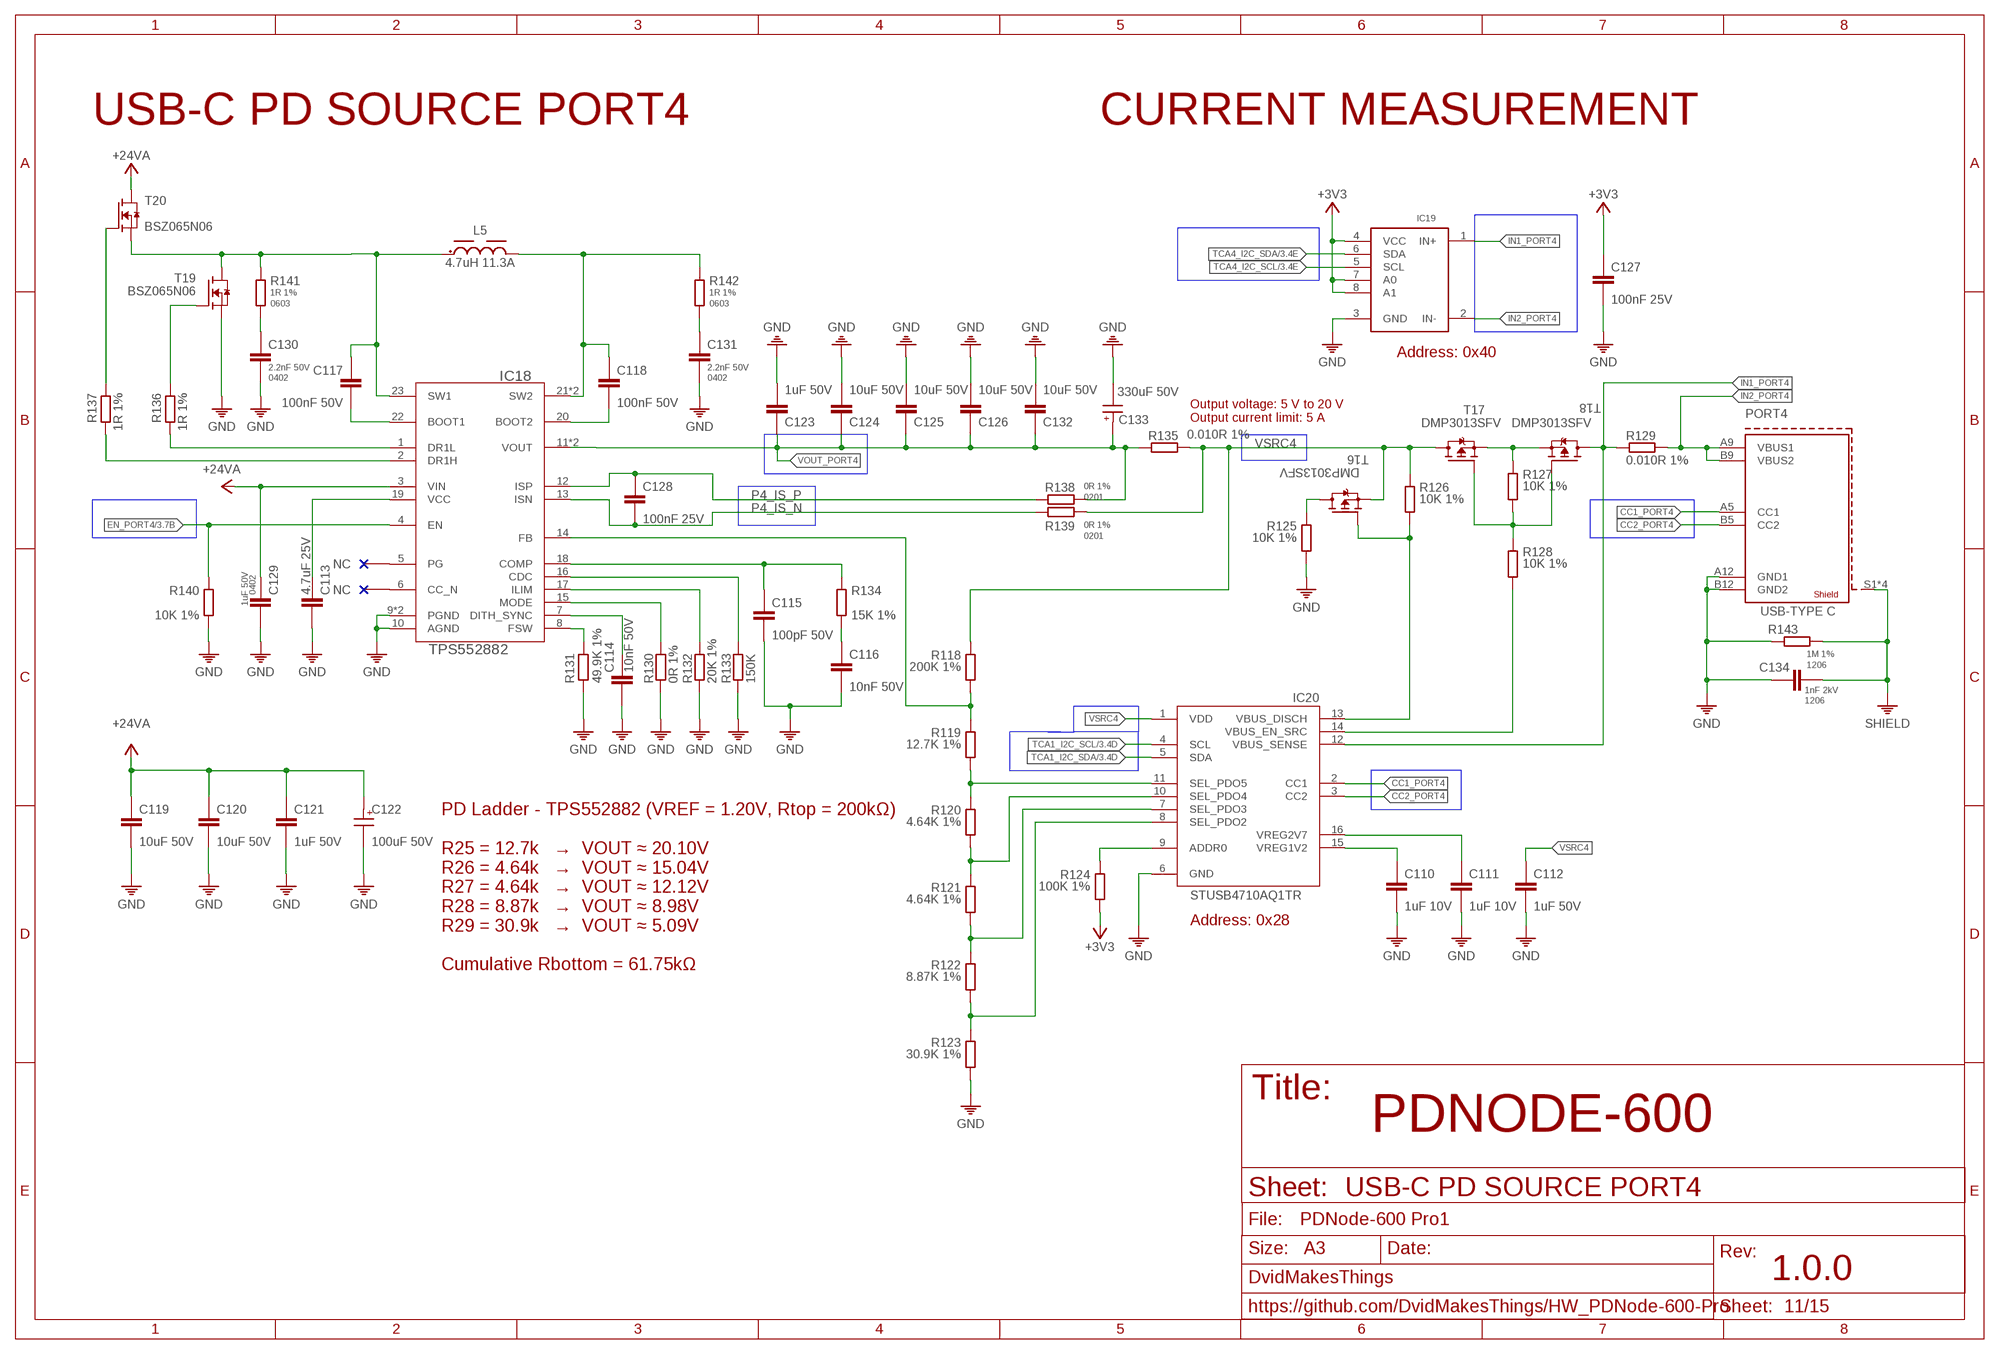
[diagram p10: schematic, sheet 11]

### Parts
C110  1uF 10V  1UF-10V0201  [0201]
C111  1uF 10V  1UF-10V0201  [0201]
C112  1uF 50V  1UF-50V0603  [0603]
C113  4.7uF 25V  4.7UF-25V0402  [0402]
C114  10nF 50V  10NF-50V-0201  [0201]
C115  100pF 50V  100PF-50V0201  [0201]
C116  10nF 50V  10NF-50V-0201  [0201]
C117  100nF 50V  100NF-50V-0402  [0402]
C118  100nF 50V  100NF-50V-0402  [0402]
C119  10uF 50V  10UF-50V-0805  [0805]
C120  10uF 50V  10UF-50V-0805  [0805]
C121  1uF 50V  1UF-50V0805  [0805]
C122  100uF 50V  100UF-50V6.3X7.7(DXL)  [6.3X7.7(DXL)]
C123  1uF 50V  1UF-50V0402  [0402]
C124  10uF 50V  10UF-50V-0805  [0805]
C125  10uF 50V  10UF-50V-0805  [0805]
C126  10uF 50V  10UF-50V-0805  [0805]
C127  100nF 25V  100NF-25V-0201  [0201]
C128  100nF 25V  100NF-25V-0201  [0201]
C129  1uF 50V  1UF-50V0402  [0402]
C130  2.2nF 50V  2.2NF-50V-0402  [0402]
C131  2.2nF 50V  2.2NF-50V-0402  [0402]
C132  10uF 50V  10UF-50V-0805  [0805]
C133  330uF 50V  330UF-50V10X10.5(DXL)  [10X10.5(DXL)]
C134  1nF 2kV  1NF-2KV  [1206]
IC18  TPS552882  [RPM0026A-MFG]
IC19  INA219BIDCNT  [SOT23-8]
IC20  STUSB4710AQ1TR  [QFN50P300X300X55-16N]
L5  4.7uH 11.3A  4.7UH-PWR  [WE-PDHV_1280]
PORT4  632722100213  USB-C-POWERONLY  [632722100213]
R118  200K 1%  200K-1%0201  [0201]
R119  12.7K 1%  12.7K-1%0201  [0201]
R120  4.64K 1%  4.64K-1%-0201  [0201]
R121  4.64K 1%  4.64K-1%-0201  [0201]
R122  8.87K 1%  8.87K-1%-0201  [0201]
R123  30.9K 1%  30.9K-1%0201  [0201]
R124  100K 1%  100K-1%0201  [0201]
R125  10K 1%  10K-1%0402  [0402]
R126  10K 1%  10K-1%0402  [0402]
R127  10K 1%  10K-1%0201  [0201]
R128  10K 1%  10K-1%0402  [0402]
R129  0.010R 1%  0.010R-1%-2512  [2512]
R130  0R 1%  0R0201  [0201]
R131  49.9K 1%  49.9K-1%0201  [0201]
R132  20K 1%  20K-1%0201  [0201]
R133  150K  R0201  [R0201]
R134  15K 1%  15K-1%0201  [0201]
R135  0.010R 1%  0.010R-1%-2512  [2512]
R136  1R 1%  1R-1%0402  [0402]
R137  1R 1%  1R-1%0402  [0402]
R138  0R 1%  0R0201  [0201]
R139  0R 1%  0R0201  [0201]
R140  10K 1%  10K-1%0201  [0201]
R141  1R 1%  1R-1%0603  [0603]
R142  1R 1%  1R-1%0603  [0603]
R143  1M 1%  1M-1%1206  [1206]
T16  DMP3013SFV  DMP3013SFV-7UX  [POWERDI3333-8_UX_DIO-L]
T17  DMP3013SFV  DMP3013SFV-7UX  [POWERDI3333-8_UX_DIO-L]
T18  DMP3013SFV  DMP3013SFV-7UX  [POWERDI3333-8_UX_DIO-L]
T19  BSZ065N06  IPZ40N04S5L7R4ATMA1  [POWERDI3333-8_UX_DIO-L]
T20  BSZ065N06  IPZ40N04S5L7R4ATMA1  [POWERDI3333-8_UX_DIO-L]

### Nets
+3V3: C127.1 IC19.4(VCC) IC19.7(A0) IC19.8(A1) R124.2 ; also sheet 1,2,3,4,5,6,7,8,9,10,12,13,14,15
+24V_A: C119.1 C120.1 C121.1 C122.1(+) C129.1 IC18.3(VIN) T20.5(D) T20.6(D) T20.7(D) T20.8(D) T20.9(D) ; supply symbol labelled +24VA ; also sheet 5,8,9,10
CC1_PORT4: IC20.2(CC1) PORT4.A5(CC1)
CC2_PORT4: IC20.3(CC2) PORT4.B5(CC2)
DISCHARGE4: R125.1 T16.5(D) T16.6(D) T16.7(D) T16.8(D) T16.9(D)
EN_PORT4: IC18.4(EN) R140.1 ; also sheet 3
GND: C110.2 C111.2 C112.2 C113.2 C114.2 C115.2 C116.2 C119.2 C120.2 C121.2 C122.2(-) C123.2 C124.2 C125.2 C126.2 C127.2 C129.2 C130.2 C131.2 C132.2 C133.2(-) C134.1 IC18.9(PGND) IC18.10(AGND) IC18.24(PGND) IC19.3(GND) IC20.6(GND) PORT4.A12(GND1) PORT4.B12(GND2) R123.2 R125.2 R130.2 R131.2 R132.2 R133.2 R140.2 R143.1 T19.1(S) T19.2(S) T19.3(S) ; also sheet 1,2,3,4,5,6,7,8,9,10,12,13,14,15
IN1_PORT4: IC19.1(IN+) IC20.12(VBUS_SENSE) R129.1 T18.5(D) T18.6(D) T18.7(D) T18.8(D) T18.9(D)
IN2_PORT4: IC19.2(IN-) PORT4.A9(VBUS1) PORT4.B9(VBUS2) R129.2
IND4: C117.1 IC18.23(SW1) L5.1 R141.1 T19.5(D) T19.6(D) T19.7(D) T19.8(D) T19.9(D) T20.1(S) T20.2(S) T20.3(S)
INDOUT4: C118.1 IC18.21(SW2) IC18.25(SW2) L5.2 R142.1
N$124: IC20.11(SEL_PDO5) R119.2 R120.1
N$125: IC20.10(SEL_PDO4) R120.2 R121.1
N$126: IC20.7(SEL_PDO3) R121.2 R122.1
N$127: IC20.8(SEL_PDO2) R122.2 R123.1
N$128: C110.1 IC20.15(VREG1V2)
N$129: C111.1 IC20.16(VREG2V7)
N$130: IC20.9(ADDR0) R124.1
N$132: IC20.13(VBUS_DISCH) R126.2 T16.4(G)
N$134: R127.2 R128.1 T17.4(G) T18.4(G)
N$135: IC20.14(VBUS_EN_SRC) R128.2
N$136: C116.1 R134.2
N$137: IC18.8(FSW) R131.1
N$138: C114.1 IC18.7(DITH_SYNC)
N$139: IC18.15(MODE) R130.1
N$140: IC18.17(ILIM) R132.1
N$141: IC18.16(CDC) R133.1
N$142: C115.1 IC18.18(COMP) R134.1
N$143: C113.1 IC18.19(VCC)
N$146: C117.2 IC18.22(BOOT1)
N$147: C118.2 IC18.20(BOOT2)
N$148: R137.2 T20.4(G)
N$149: R136.2 T19.4(G)
N$150: IC18.1(DR1L) R136.1
N$151: IC18.2(DR1H) R137.1
N$152: IC18.14(FB) R118.2 R119.1
N$153: C130.1 R141.2
N$154: C131.1 R142.2
P4_IS_N [50R_DIFFPAIR]: C128.2 IC18.13(ISN) R139.1
P4_IS_P [50R_DIFFPAIR]: C128.1 IC18.12(ISP) R138.1
SHIELD: C134.2 PORT4.S1(SHIELD1) PORT4.S2(SHIELD1) PORT4.S3(SHIELD1) PORT4.S4(SHIELD1) R143.2 ; also sheet 3,4,6,7,8,9,10,12,13,14,15
SOURCE4: R127.1 T17.1(S) T17.2(S) T17.3(S) T18.1(S) T18.2(S) T18.3(S)
TCA1_I2C_SCL: IC20.4(SCL) ; also sheet 3,10
TCA1_I2C_SDA: IC20.5(SDA) ; also sheet 3,10
TCA4_I2C_SCL: IC19.5(SCL) ; also sheet 3,8,9,10
TCA4_I2C_SDA: IC19.6(SDA) ; also sheet 3,8,9,10
VOUT_PORT4: C123.1 C124.1 C125.1 C126.1 C132.1 C133.1(+) IC18.11(VOUT) IC18.26(VOUT) R135.1 R138.2
VSRC4: C112.1 IC20.1(VDD) R118.1 R126.1 R135.2 R139.2 T16.1(S) T16.2(S) T16.3(S) T17.5(D) T17.6(D) T17.7(D) T17.8(D) T17.9(D)
Unconnected: IC18.5(PG) IC18.6(CC_N)

### Notes on the sheet
- USB-C PD SOURCE PORT4 | CURRENT MEASUREMENT
- Address: 0x40
- Output voltage: 5 V to 20 V
  Output current limit: 5 A
- Address: 0x28
- PD Ladder - TPS552882 (VREF = 1.20V, Rtop = 200kΩ)
  
  R25 = 12.7k   →  VOUT ≈ 20.10V
  R26 = 4.64k   →  VOUT ≈ 15.04V
  R27 = 4.64k   →  VOUT ≈ 12.12V
  R28 = 8.87k   →  VOUT ≈ 8.98V
  R29 = 30.9k   →  VOUT ≈ 5.09V
  
  Cumulative Rbottom = 61.75kΩ
- PDNODE-600
- USB-C PD SOURCE PORT4